# EAGLE schematic Battery Interface Module (EAGLE 5.12)
AUTHORNAME: Aaron Bonnell-Kangas; BOARDNAME: Battery Interface Module; BOM: EXCLUDE; DATABASE: ../../../Component libraries/partsdb.txt; DNP: T; PARTNO: LGQ971; RELEASE: RELEASE; REVISIONDATE: v2.0.1 - 2015-04-01; TP_NAME: 1-SCLK_H

## Sheet 1 of 15
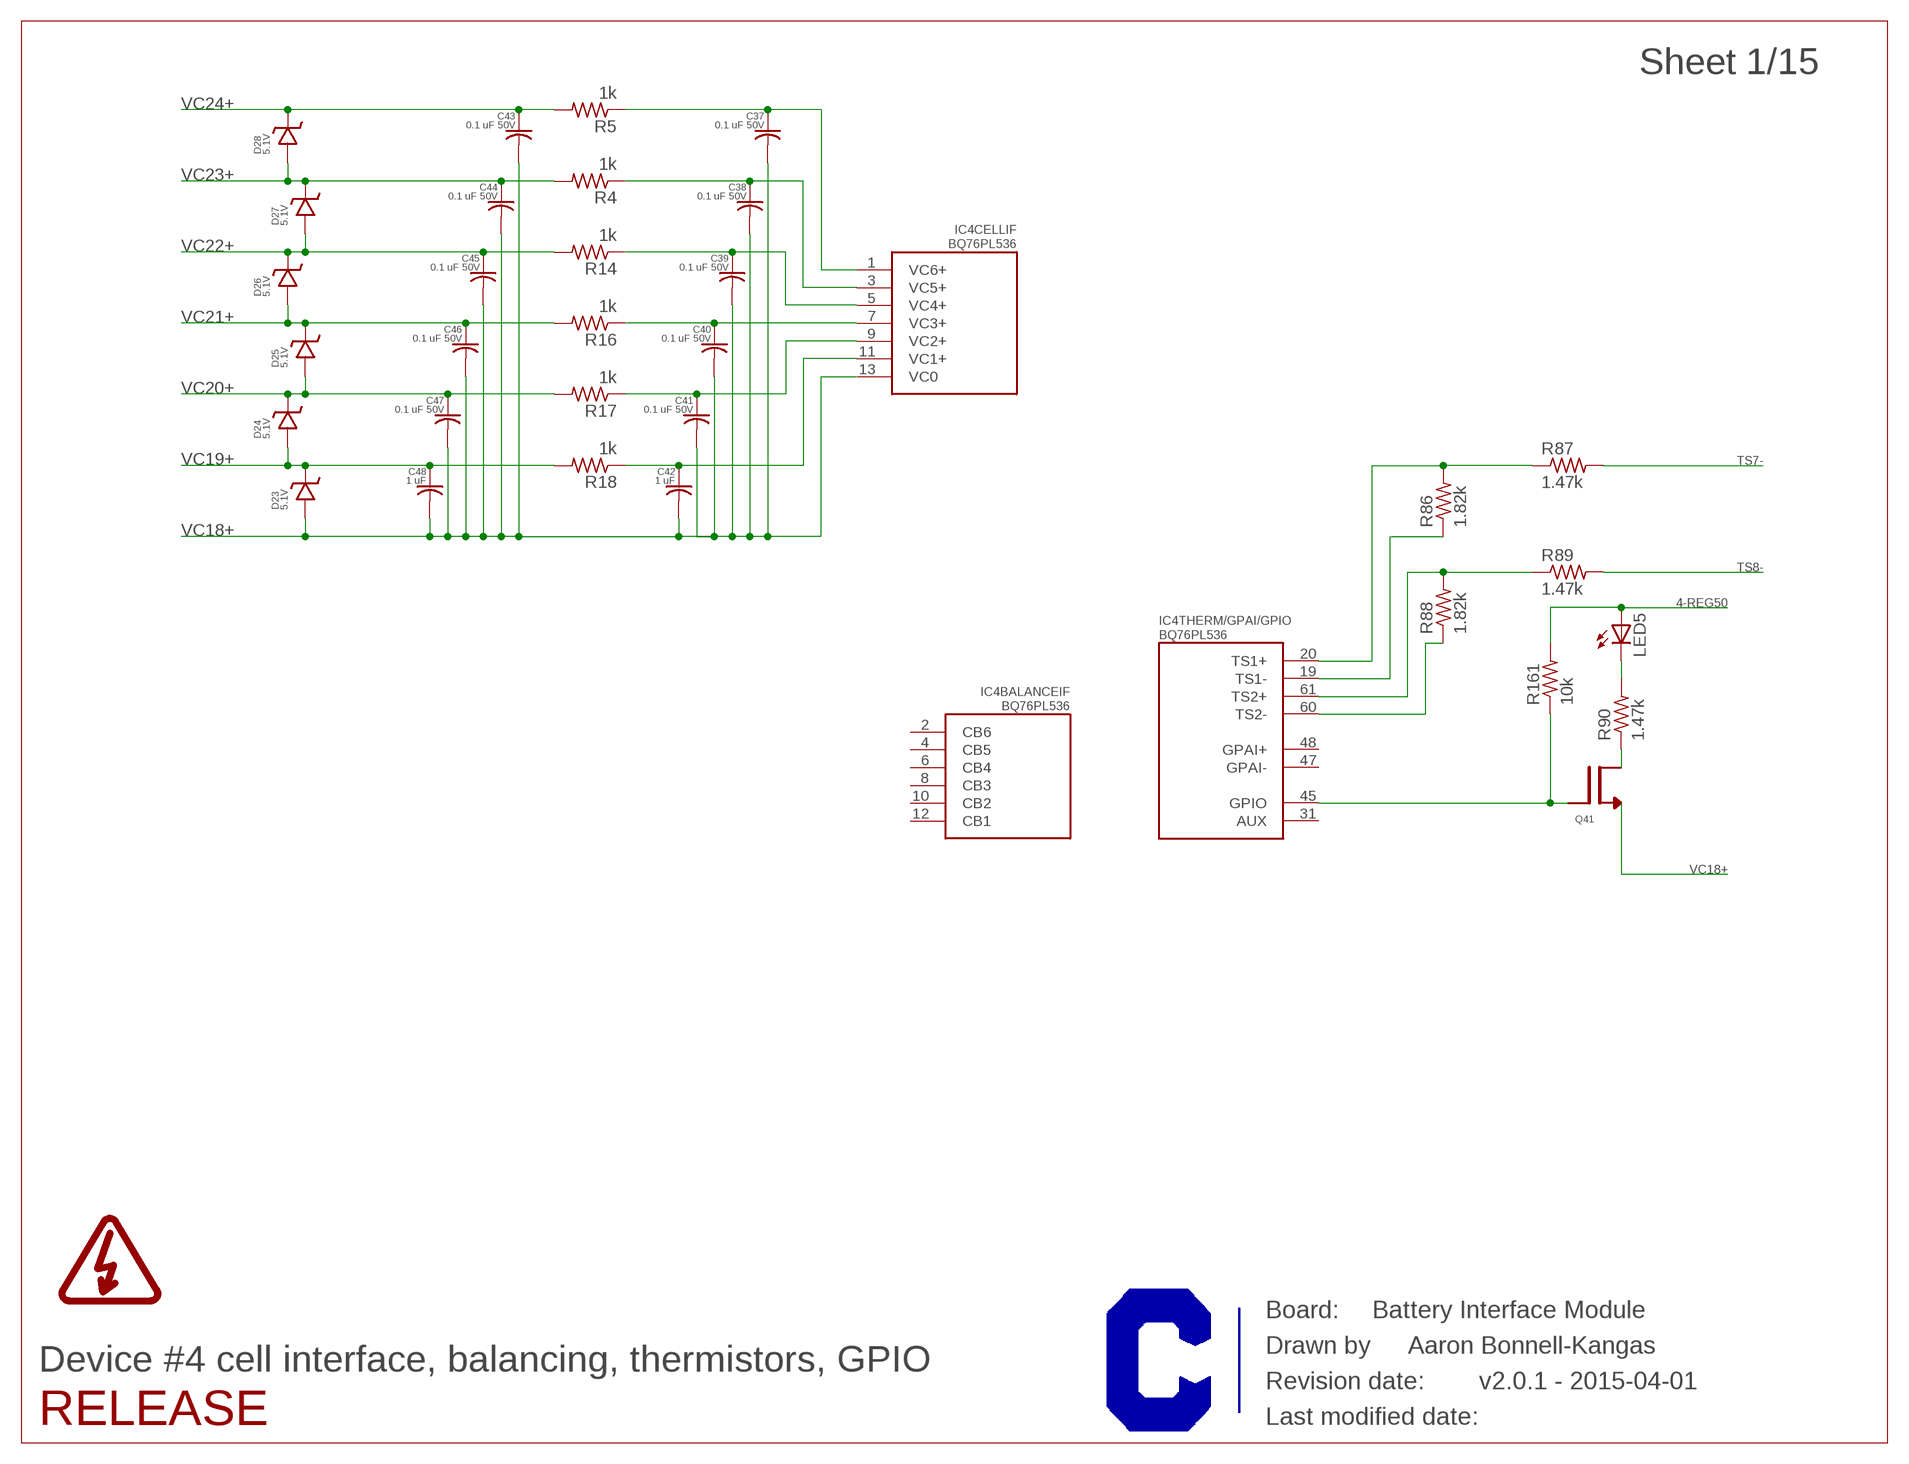
[diagram p0: schematic, sheet 1]

### Parts
C37  0.1 uF 50V  C-USC0603  [C0603]
C38  0.1 uF 50V  C-USC0603  [C0603]
C39  0.1 uF 50V  C-USC0603  [C0603]
C40  0.1 uF 50V  C-USC0603  [C0603]
C41  0.1 uF 50V  C-USC0603  [C0603]
C42  1 uF  C-USC0603  [C0603]
C43  0.1 uF 50V  C-USC0603  [C0603]
C44  0.1 uF 50V  C-USC0603  [C0603]
C45  0.1 uF 50V  C-USC0603  [C0603]
C46  0.1 uF 50V  C-USC0603  [C0603]
C47  0.1 uF 50V  C-USC0603  [C0603]
C48  1 uF  C-USC0603  [C0603]
D23  5.1V  ZENER_DIODE-SOD-323  [SOD-323]
D24  5.1V  ZENER_DIODE-SOD-323  [SOD-323]
D25  5.1V  ZENER_DIODE-SOD-323  [SOD-323]
D26  5.1V  ZENER_DIODE-SOD-323  [SOD-323]
D27  5.1V  ZENER_DIODE-SOD-323  [SOD-323]
D28  5.1V  ZENER_DIODE-SOD-323  [SOD-323]
IC4  BQ76PL536  [LQFP64-POWERPAD_(S-PQFP-G64)]
LED5  LEDCHIP-LED0603  [CHIP-LED0603]
Q41  FDN359AN  [SOT-23]
R4  1k  R-US_R0603  [R0603]
R5  1k  R-US_R0603  [R0603]
R14  1k  R-US_R0603  [R0603]
R16  1k  R-US_R0603  [R0603]
R17  1k  R-US_R0603  [R0603]
R18  1k  R-US_R0603  [R0603]
R86  1.82k  R-US_R0603  [R0603]
R87  1.47k  R-US_R0603  [R0603]
R88  1.82k  R-US_R0603  [R0603]
R89  1.47k  R-US_R0603  [R0603]
R90  1.47k  R-US_R0603  [R0603]
R161  10k  R-US_R0603  [R0603]
U$17  HV_SYMBOL  [HV_SYMBOL]

### Nets
4-GPIO: IC4.45(THERM/GPAI/GPIO:GPIO) Q41.1(GATE) R161.1
4-REG50: LED5.A R161.2 ; also sheet 2,9,15
N$34: C39.1 IC4.5(CELLIF:VC4+) R14.1
N$43: C37.1 IC4.1(CELLIF:VC6+) R5.1
N$44: C38.1 IC4.3(CELLIF:VC5+) R4.1
N$45: C41.1 IC4.9(CELLIF:VC2+) R17.1
N$47: C40.1 IC4.7(CELLIF:VC3+) R16.1
N$48: C42.1 IC4.11(CELLIF:VC1+) R18.1
N$108: IC4.19(THERM/GPAI/GPIO:TS1-) R86.1
N$109: IC4.20(THERM/GPAI/GPIO:TS1+) R86.2 R87.1
N$110: IC4.61(THERM/GPAI/GPIO:TS2+) R88.2 R89.1
N$111: IC4.60(THERM/GPAI/GPIO:TS2-) R88.1
N$114: Q41.3(DRAIN) R90.1
N$115: LED5.C R90.2
TS7-: R87.2 ; also sheet 9
TS8-: R89.2 ; also sheet 9
VC18+ [HV]: C37.2 C38.2 C39.2 C40.2 C41.2 C42.2 C43.2 C44.2 C45.2 C46.2 C47.2 C48.2 D23.ANODE IC4.13(CELLIF:VC0) Q41.2(SOURCE) ; also sheet 2,3,4,9
VC19+: C48.1 D23.CATHODE D24.ANODE R18.2 ; also sheet 9
VC20+: C47.1 D24.CATHODE D25.ANODE R17.2 ; also sheet 9
VC21+: C46.1 D25.CATHODE D26.ANODE R16.2 ; also sheet 9
VC22+: C45.1 D26.CATHODE D27.ANODE R14.2 ; also sheet 9
VC23+: C44.1 D27.CATHODE D28.ANODE R4.2 ; also sheet 9
VC24+ [HV]: C43.1 D28.CATHODE R5.2 ; also sheet 2,9,15
Unconnected: IC4.2(BALANCEIF:CB6) IC4.4(BALANCEIF:CB5) IC4.6(BALANCEIF:CB4) IC4.8(BALANCEIF:CB3) IC4.10(BALANCEIF:CB2) IC4.12(BALANCEIF:CB1) IC4.31(THERM/GPAI/GPIO:AUX) IC4.47(THERM/GPAI/GPIO:GPAI-) IC4.48(THERM/GPAI/GPIO:GPAI+)

### Notes on the sheet
- Device #4 cell interface, balancing, thermistors, GPIO

## Sheet 2 of 15
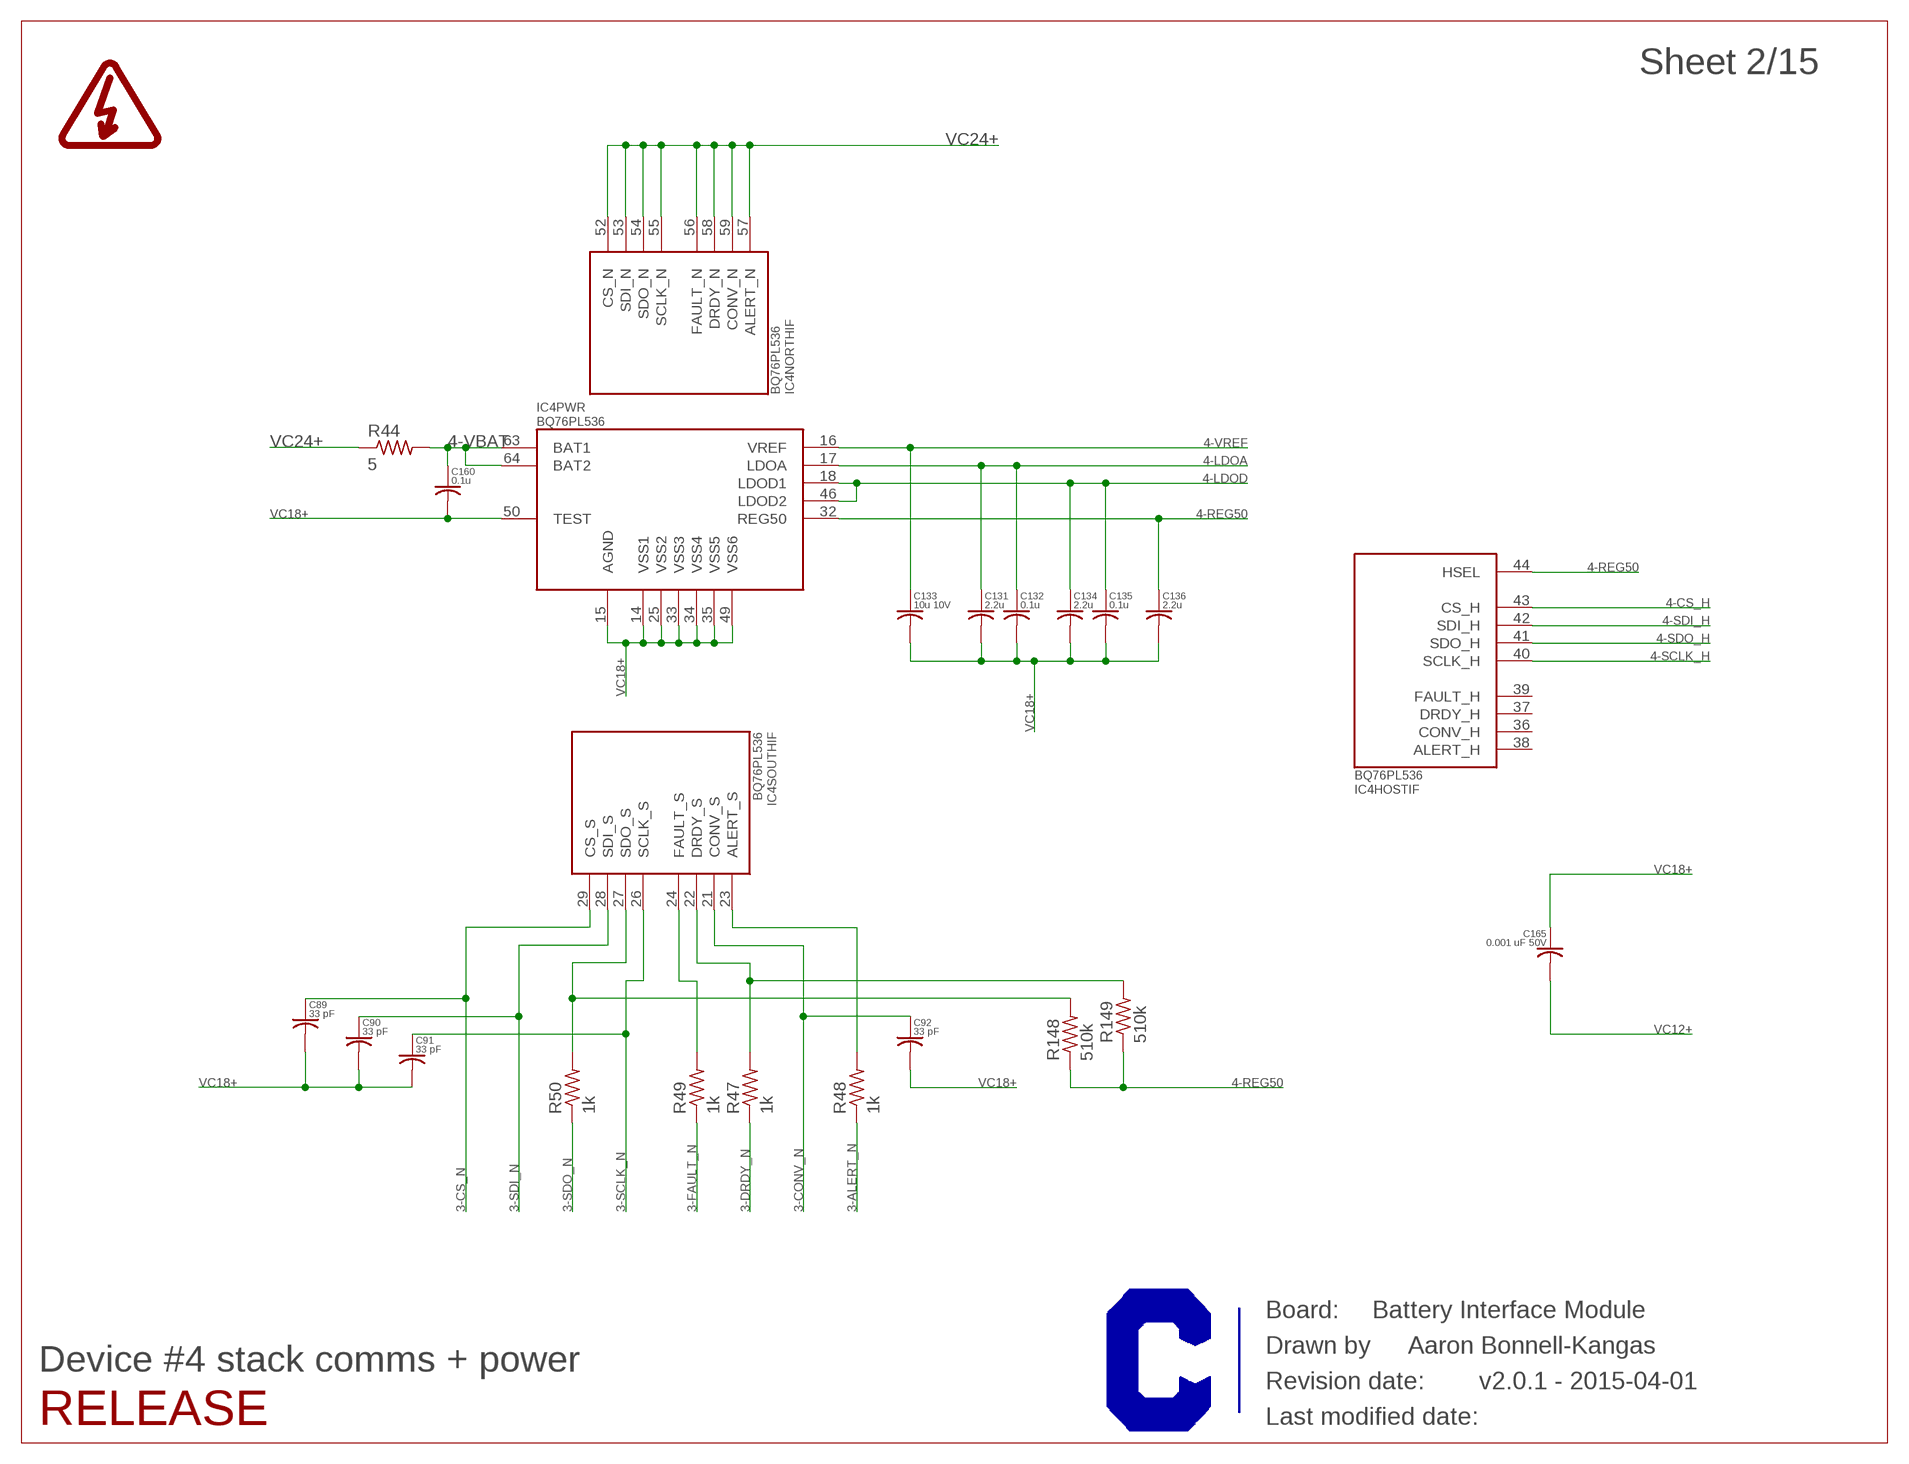
[diagram p1: schematic, sheet 2]

### Parts
C89  33 pF  C-USC0402  [C0402]
C90  33 pF  C-USC0402  [C0402]
C91  33 pF  C-USC0402  [C0402]
C92  33 pF  C-USC0402  [C0402]
C131  2.2u  C-USC0603  [C0603]
C132  0.1u  C-USC0603  [C0603]
C133  10u 10V  C-USC0805  [C0805]
C134  2.2u  C-USC0603  [C0603]
C135  0.1u  C-USC0603  [C0603]
C136  2.2u  C-USC0603  [C0603]
C160  0.1u  C-USC0603  [C0603]
C165  0.001 uF 50V  C-USC0603  [C0603]
R44  5  R-US_R0603  [R0603]
R47  1k  R-US_R0402  [R0402]
R48  1k  R-US_R0402  [R0402]
R49  1k  R-US_R0402  [R0402]
R50  1k  R-US_R0402  [R0402]
R148  510k  R-US_R0603  [R0603]
R149  510k  R-US_R0603  [R0603]
U$2  HV_SYMBOL  [HV_SYMBOL]

### Nets
3-ALERT_N: R48.1 ; also sheet 4
3-CONV_N: C92.1 IC4.21(SOUTHIF:CONV_S) ; also sheet 4
3-CS_N: C89.1 IC4.29(SOUTHIF:CS_S) ; also sheet 4
3-DRDY_N: R47.1 ; also sheet 4
3-FAULT_N: R49.1 ; also sheet 4
3-SCLK_N: C91.1 IC4.26(SOUTHIF:SCLK_S) ; also sheet 4
3-SDI_N: C90.1 IC4.28(SOUTHIF:SDI_S) ; also sheet 4
3-SDO_N: R50.1 ; also sheet 4
4-CS_H: IC4.43(HOSTIF:CS_H) ; also sheet 15
4-LDOA: C131.1 C132.1 IC4.17(PWR:LDOA)
4-LDOD: C134.1 C135.1 IC4.18(PWR:LDOD1) IC4.46(PWR:LDOD2)
4-REG50: C136.1 IC4.32(PWR:REG50) IC4.44(HOSTIF:HSEL) R148.1 R149.1 ; also sheet 1,9,15
4-SCLK_H: IC4.40(HOSTIF:SCLK_H) ; also sheet 15
4-SDI_H: IC4.42(HOSTIF:SDI_H) ; also sheet 15
4-SDO_H: IC4.41(HOSTIF:SDO_H) ; also sheet 15
4-VBAT: C160.1 IC4.63(PWR:BAT1) IC4.64(PWR:BAT2) R44.2
4-VREF: C133.1 IC4.16(PWR:VREF)
N$205: IC4.24(SOUTHIF:FAULT_S) R49.2
N$207: IC4.23(SOUTHIF:ALERT_S) R48.2
N$209: IC4.22(SOUTHIF:DRDY_S) R47.2 R149.2
N$210: IC4.27(SOUTHIF:SDO_S) R50.2 R148.2
VC12+ [HV]: C165.2 ; also sheet 3,4,5,6,9,15
VC18+ [HV]: C89.2 C90.2 C91.2 C92.2 C131.2 C132.2 C133.2 C134.2 C135.2 C136.2 C160.2 C165.1 IC4.14(PWR:VSS1) IC4.15(PWR:AGND) IC4.25(PWR:VSS2) IC4.33(PWR:VSS3) IC4.34(PWR:VSS4) IC4.35(PWR:VSS5) IC4.49(PWR:VSS6) IC4.50(PWR:TEST) ; also sheet 1,3,4,9
VC24+ [HV]: IC4.52(NORTHIF:CS_N) IC4.53(NORTHIF:SDI_N) IC4.54(NORTHIF:SDO_N) IC4.55(NORTHIF:SCLK_N) IC4.56(NORTHIF:FAULT_N) IC4.57(NORTHIF:ALERT_N) IC4.58(NORTHIF:DRDY_N) IC4.59(NORTHIF:CONV_N) R44.1 ; also sheet 1,9,15
Unconnected: IC4.36(HOSTIF:CONV_H) IC4.37(HOSTIF:DRDY_H) IC4.38(HOSTIF:ALERT_H) IC4.39(HOSTIF:FAULT_H)

### Notes on the sheet
- Device #4 stack comms + power

## Sheet 3 of 15
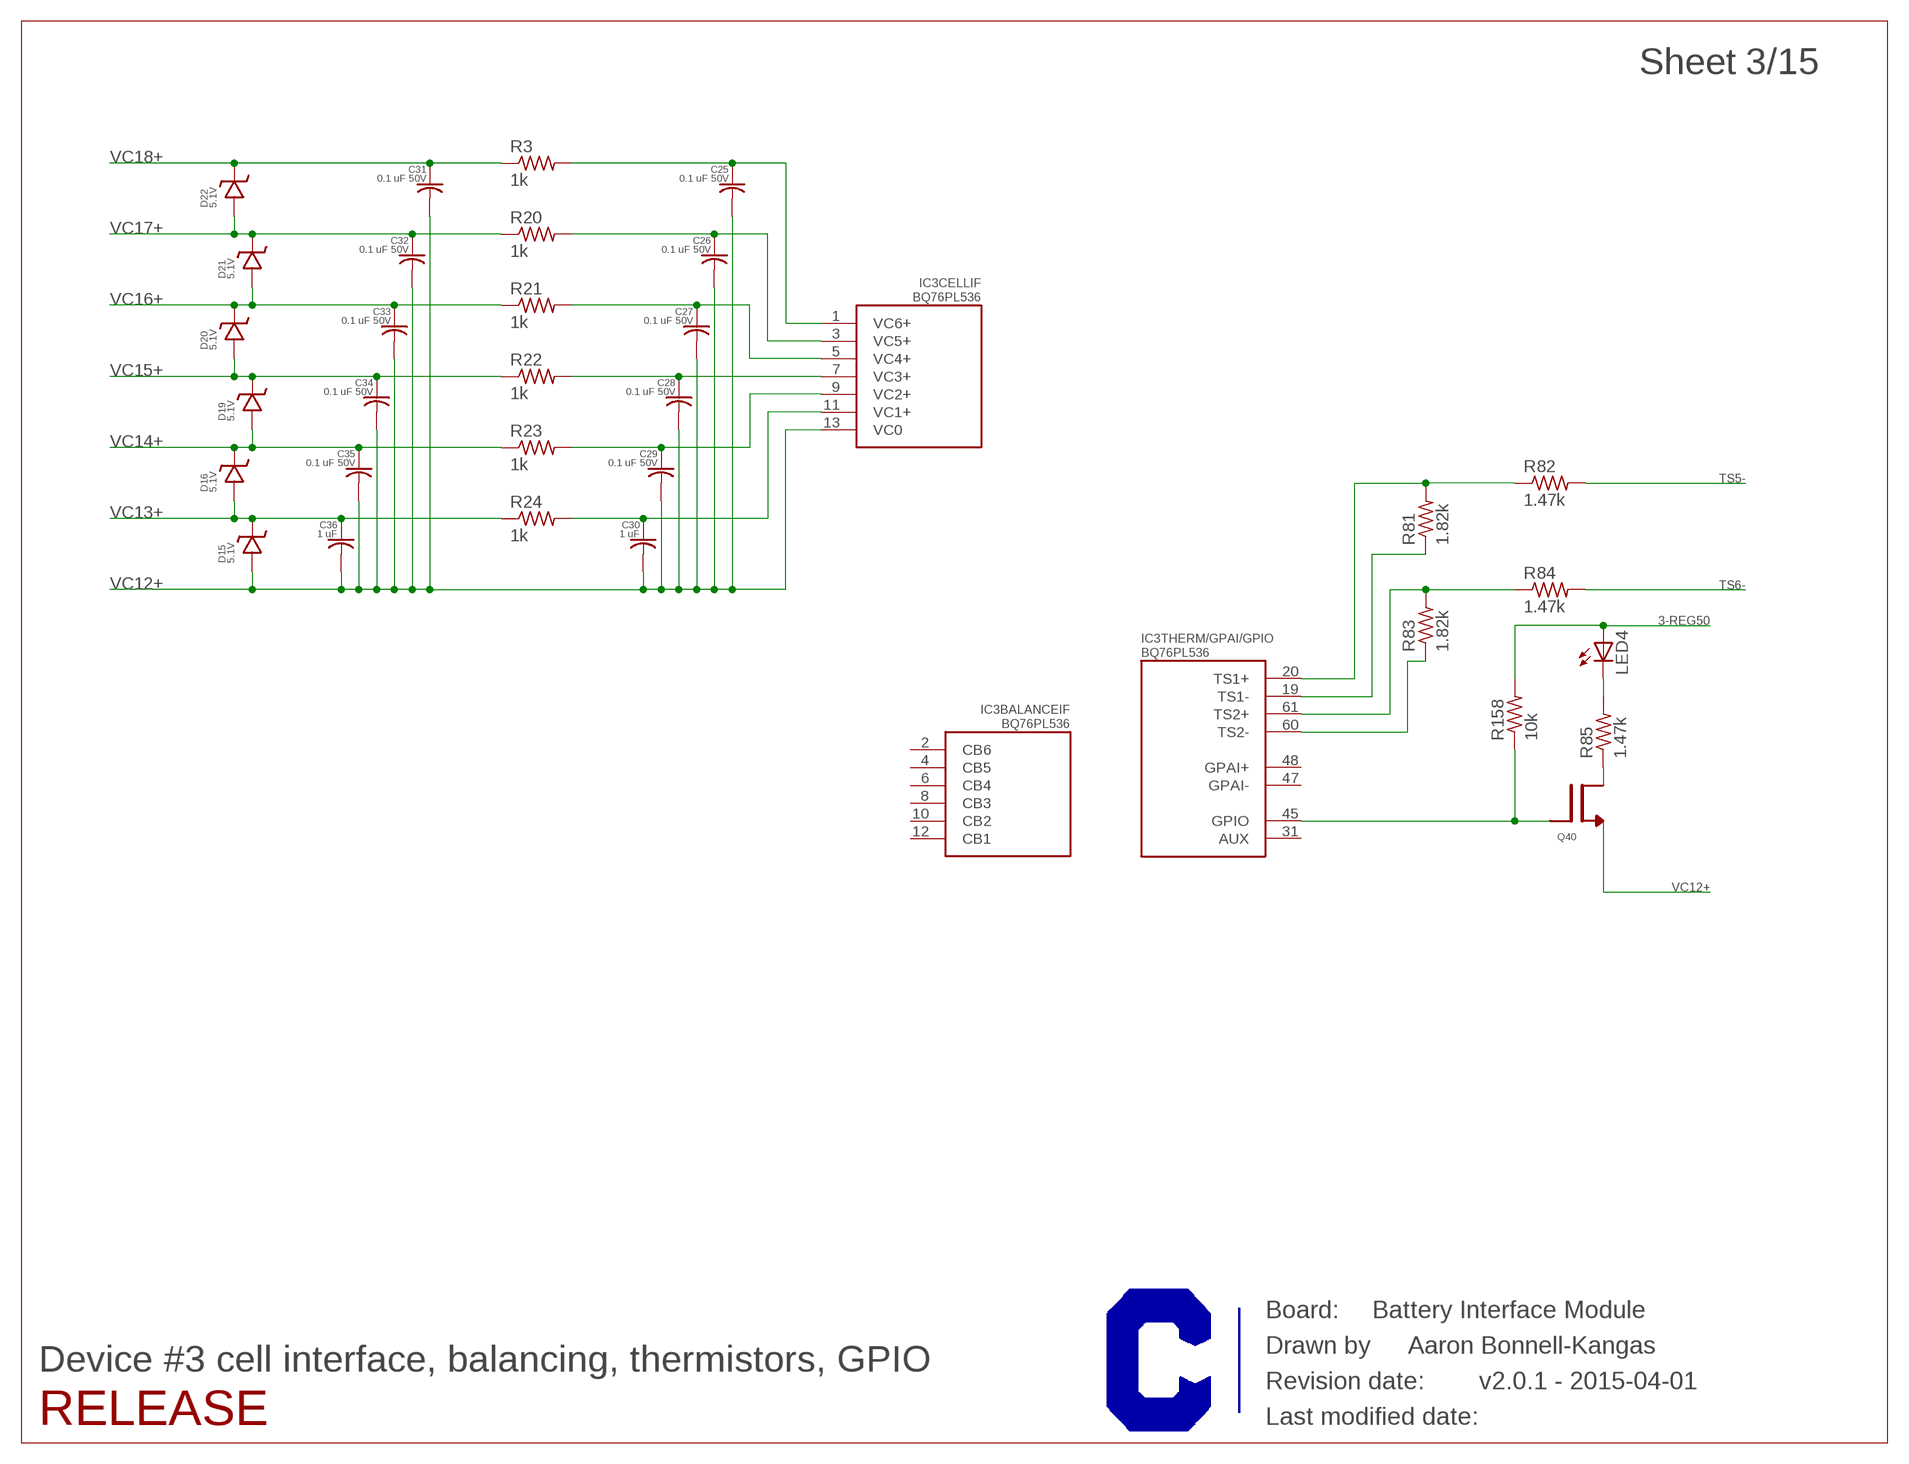
[diagram p2: schematic, sheet 3]

### Parts
C25  0.1 uF 50V  C-USC0603  [C0603]
C26  0.1 uF 50V  C-USC0603  [C0603]
C27  0.1 uF 50V  C-USC0603  [C0603]
C28  0.1 uF 50V  C-USC0603  [C0603]
C29  0.1 uF 50V  C-USC0603  [C0603]
C30  1 uF  C-USC0603  [C0603]
C31  0.1 uF 50V  C-USC0603  [C0603]
C32  0.1 uF 50V  C-USC0603  [C0603]
C33  0.1 uF 50V  C-USC0603  [C0603]
C34  0.1 uF 50V  C-USC0603  [C0603]
C35  0.1 uF 50V  C-USC0603  [C0603]
C36  1 uF  C-USC0603  [C0603]
D15  5.1V  ZENER_DIODE-SOD-323  [SOD-323]
D16  5.1V  ZENER_DIODE-SOD-323  [SOD-323]
D19  5.1V  ZENER_DIODE-SOD-323  [SOD-323]
D20  5.1V  ZENER_DIODE-SOD-323  [SOD-323]
D21  5.1V  ZENER_DIODE-SOD-323  [SOD-323]
D22  5.1V  ZENER_DIODE-SOD-323  [SOD-323]
IC3  BQ76PL536  [LQFP64-POWERPAD_(S-PQFP-G64)]
LED4  LEDCHIP-LED0603  [CHIP-LED0603]
Q40  FDN359AN  [SOT-23]
R3  1k  R-US_R0603  [R0603]
R20  1k  R-US_R0603  [R0603]
R21  1k  R-US_R0603  [R0603]
R22  1k  R-US_R0603  [R0603]
R23  1k  R-US_R0603  [R0603]
R24  1k  R-US_R0603  [R0603]
R81  1.82k  R-US_R0603  [R0603]
R82  1.47k  R-US_R0603  [R0603]
R83  1.82k  R-US_R0603  [R0603]
R84  1.47k  R-US_R0603  [R0603]
R85  1.47k  R-US_R0603  [R0603]
R158  10k  R-US_R0603  [R0603]

### Nets
3-GPIO: IC3.45(THERM/GPAI/GPIO:GPIO) Q40.1(GATE) R158.1
3-REG50: LED4.A R158.2 ; also sheet 4,9,15
N$15: C25.1 IC3.1(CELLIF:VC6+) R3.2
N$20: C30.1 IC3.11(CELLIF:VC1+) R24.2
N$29: C28.1 IC3.7(CELLIF:VC3+) R22.2
N$30: C26.1 IC3.3(CELLIF:VC5+) R20.2
N$31: C27.1 IC3.5(CELLIF:VC4+) R21.2
N$33: C29.1 IC3.9(CELLIF:VC2+) R23.2
N$78: IC3.19(THERM/GPAI/GPIO:TS1-) R81.1
N$80: IC3.20(THERM/GPAI/GPIO:TS1+) R81.2 R82.1
N$82: IC3.61(THERM/GPAI/GPIO:TS2+) R83.2 R84.1
N$94: IC3.60(THERM/GPAI/GPIO:TS2-) R83.1
N$105: Q40.3(DRAIN) R85.1
N$106: LED4.C R85.2
TS5-: R82.2 ; also sheet 9
TS6-: R84.2 ; also sheet 9
VC12+ [HV]: C25.2 C26.2 C27.2 C28.2 C29.2 C30.2 C31.2 C32.2 C33.2 C34.2 C35.2 C36.2 D15.ANODE IC3.13(CELLIF:VC0) Q40.2(SOURCE) ; also sheet 2,4,5,6,9,15
VC13+: C36.1 D15.CATHODE D16.ANODE R24.1 ; also sheet 9
VC14+: C35.1 D16.CATHODE D19.ANODE R23.1 ; also sheet 9
VC15+: C34.1 D19.CATHODE D20.ANODE R22.1 ; also sheet 9
VC16+: C33.1 D20.CATHODE D21.ANODE R21.1 ; also sheet 9
VC17+: C32.1 D21.CATHODE D22.ANODE R20.1 ; also sheet 9
VC18+ [HV]: C31.1 D22.CATHODE R3.1 ; also sheet 1,2,4,9
Unconnected: IC3.2(BALANCEIF:CB6) IC3.4(BALANCEIF:CB5) IC3.6(BALANCEIF:CB4) IC3.8(BALANCEIF:CB3) IC3.10(BALANCEIF:CB2) IC3.12(BALANCEIF:CB1) IC3.31(THERM/GPAI/GPIO:AUX) IC3.47(THERM/GPAI/GPIO:GPAI-) IC3.48(THERM/GPAI/GPIO:GPAI+)

### Notes on the sheet
- Device #3 cell interface, balancing, thermistors, GPIO

## Sheet 4 of 15
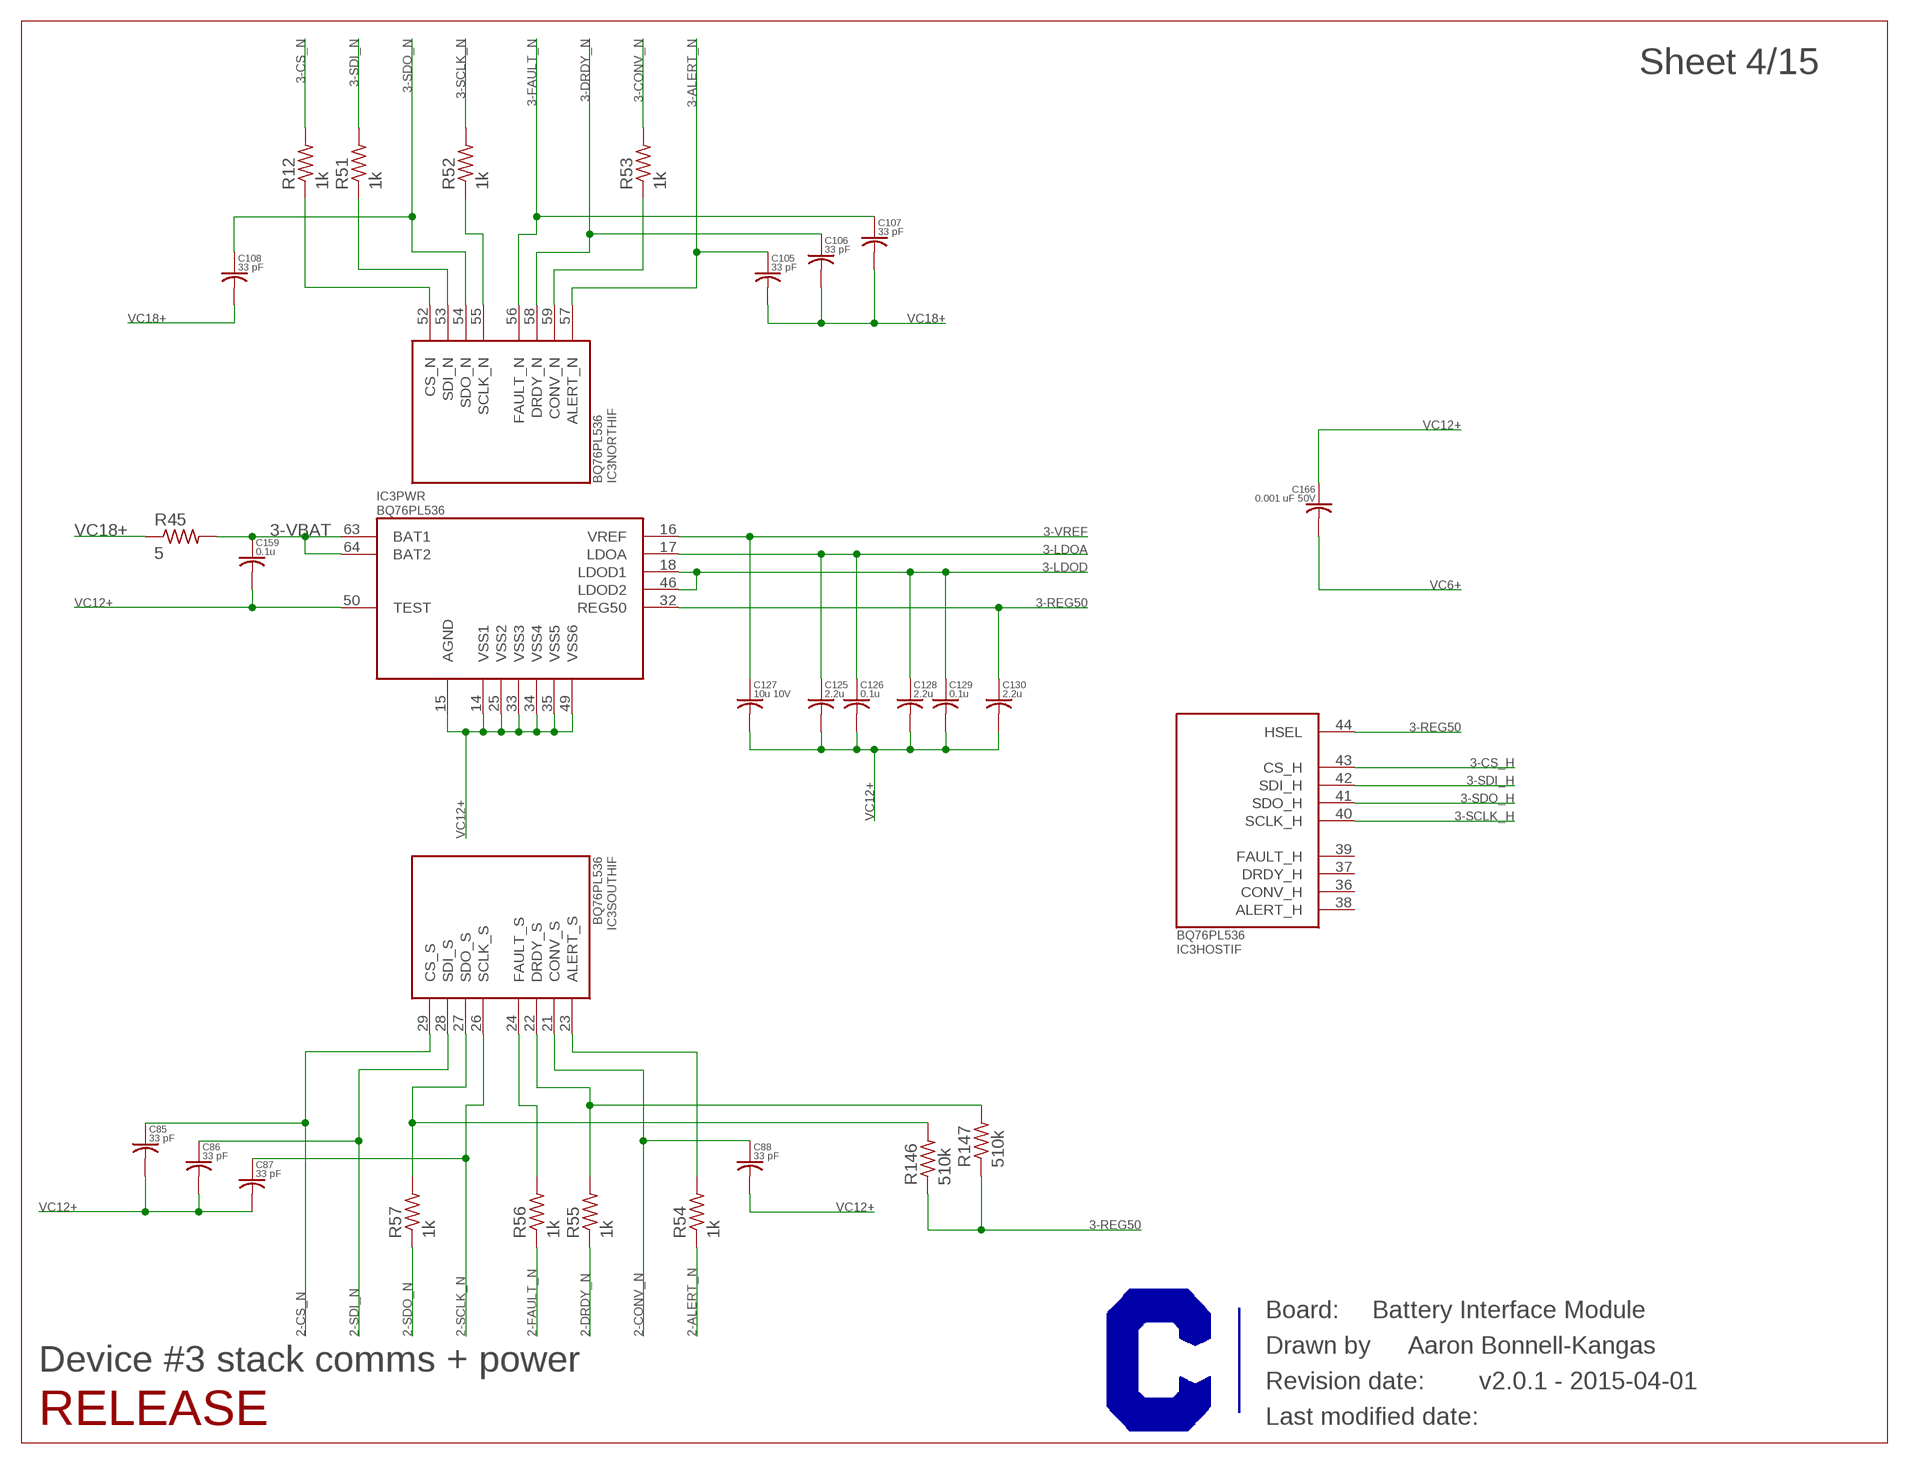
[diagram p3: schematic, sheet 4]

### Parts
C85  33 pF  C-USC0402  [C0402]
C86  33 pF  C-USC0402  [C0402]
C87  33 pF  C-USC0402  [C0402]
C88  33 pF  C-USC0402  [C0402]
C105  33 pF  C-USC0402  [C0402]
C106  33 pF  C-USC0402  [C0402]
C107  33 pF  C-USC0402  [C0402]
C108  33 pF  C-USC0402  [C0402]
C125  2.2u  C-USC0603  [C0603]
C126  0.1u  C-USC0603  [C0603]
C127  10u 10V  C-USC0805  [C0805]
C128  2.2u  C-USC0603  [C0603]
C129  0.1u  C-USC0603  [C0603]
C130  2.2u  C-USC0603  [C0603]
C159  0.1u  C-USC0603  [C0603]
C166  0.001 uF 50V  C-USC0603  [C0603]
R12  1k  R-US_R0402  [R0402]
R45  5  R-US_R0603  [R0603]
R51  1k  R-US_R0402  [R0402]
R52  1k  R-US_R0402  [R0402]
R53  1k  R-US_R0402  [R0402]
R54  1k  R-US_R0402  [R0402]
R55  1k  R-US_R0402  [R0402]
R56  1k  R-US_R0402  [R0402]
R57  1k  R-US_R0402  [R0402]
R146  510k  R-US_R0402  [R0402]
R147  510k  R-US_R0402  [R0402]

### Nets
2-ALERT_N: R54.1 ; also sheet 6
2-CONV_N: C88.1 IC3.21(SOUTHIF:CONV_S) ; also sheet 6
2-CS_N: C85.1 IC3.29(SOUTHIF:CS_S) ; also sheet 6
2-DRDY_N: R55.1 ; also sheet 6
2-FAULT_N: R56.1 ; also sheet 6
2-SCLK_N: C87.1 IC3.26(SOUTHIF:SCLK_S) ; also sheet 6
2-SDI_N: C86.1 IC3.28(SOUTHIF:SDI_S) ; also sheet 6
2-SDO_N: R57.1 ; also sheet 6
3-ALERT_N: C105.1 IC3.57(NORTHIF:ALERT_N) ; also sheet 2
3-CONV_N: R53.2 ; also sheet 2
3-CS_H: IC3.43(HOSTIF:CS_H) ; also sheet 15
3-CS_N: R12.2 ; also sheet 2
3-DRDY_N: C106.1 IC3.58(NORTHIF:DRDY_N) ; also sheet 2
3-FAULT_N: C107.1 IC3.56(NORTHIF:FAULT_N) ; also sheet 2
3-LDOA: C125.1 C126.1 IC3.17(PWR:LDOA)
3-LDOD: C128.1 C129.1 IC3.18(PWR:LDOD1) IC3.46(PWR:LDOD2)
3-REG50: C130.1 IC3.32(PWR:REG50) IC3.44(HOSTIF:HSEL) R146.1 R147.1 ; also sheet 3,9,15
3-SCLK_H: IC3.40(HOSTIF:SCLK_H) ; also sheet 15
3-SCLK_N: R52.2 ; also sheet 2
3-SDI_H: IC3.42(HOSTIF:SDI_H) ; also sheet 15
3-SDI_N: R51.2 ; also sheet 2
3-SDO_H: IC3.41(HOSTIF:SDO_H) ; also sheet 15
3-SDO_N: C108.1 IC3.54(NORTHIF:SDO_N) ; also sheet 2
3-VBAT: C159.1 IC3.63(PWR:BAT1) IC3.64(PWR:BAT2) R45.2
3-VREF: C127.1 IC3.16(PWR:VREF)
N$79: IC3.24(SOUTHIF:FAULT_S) R56.2
N$81: IC3.23(SOUTHIF:ALERT_S) R54.2
N$83: IC3.22(SOUTHIF:DRDY_S) R55.2 R147.2
N$84: IC3.27(SOUTHIF:SDO_S) R57.2 R146.2
N$254: IC3.59(NORTHIF:CONV_N) R53.1
N$257: IC3.55(NORTHIF:SCLK_N) R52.1
N$259: IC3.53(NORTHIF:SDI_N) R51.1
N$260: IC3.52(NORTHIF:CS_N) R12.1
VC6+ [HV]: C166.2 ; also sheet 5,6,7,8,9,15
VC12+ [HV]: C85.2 C86.2 C87.2 C88.2 C125.2 C126.2 C127.2 C128.2 C129.2 C130.2 C159.2 C166.1 IC3.14(PWR:VSS1) IC3.15(PWR:AGND) IC3.25(PWR:VSS2) IC3.33(PWR:VSS3) IC3.34(PWR:VSS4) IC3.35(PWR:VSS5) IC3.49(PWR:VSS6) IC3.50(PWR:TEST) ; also sheet 2,3,5,6,9,15
VC18+ [HV]: C105.2 C106.2 C107.2 C108.2 R45.1 ; also sheet 1,2,3,9
Unconnected: IC3.36(HOSTIF:CONV_H) IC3.37(HOSTIF:DRDY_H) IC3.38(HOSTIF:ALERT_H) IC3.39(HOSTIF:FAULT_H)

### Notes on the sheet
- Device #3 stack comms + power

## Sheet 5 of 15
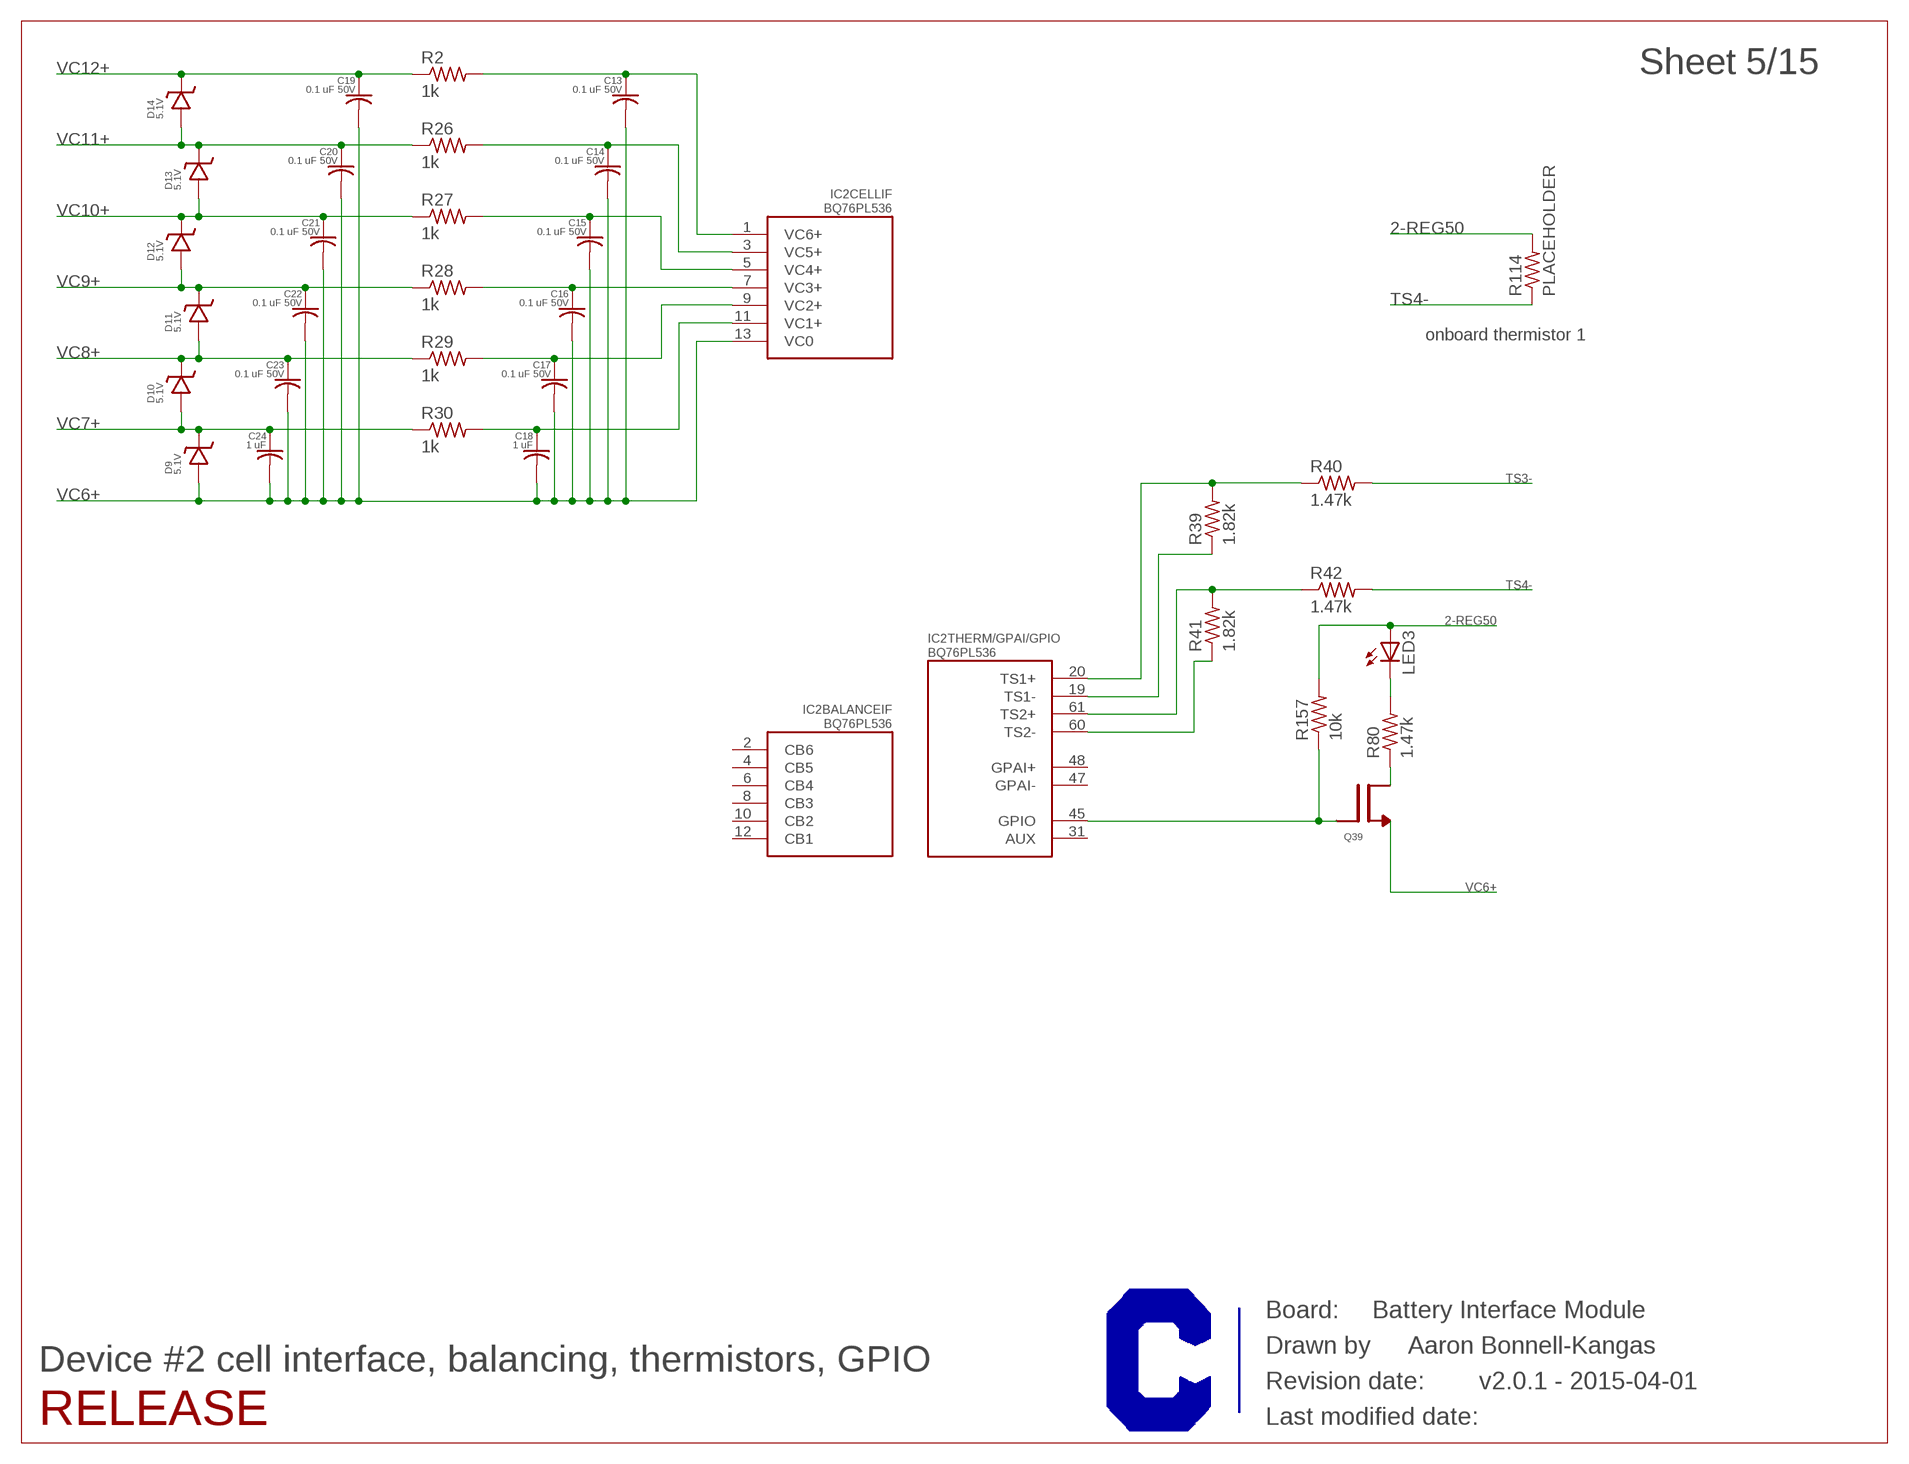
[diagram p4: schematic, sheet 5]

### Parts
C13  0.1 uF 50V  C-USC0603  [C0603]
C14  0.1 uF 50V  C-USC0603  [C0603]
C15  0.1 uF 50V  C-USC0603  [C0603]
C16  0.1 uF 50V  C-USC0603  [C0603]
C17  0.1 uF 50V  C-USC0603  [C0603]
C18  1 uF  C-USC0603  [C0603]
C19  0.1 uF 50V  C-USC0603  [C0603]
C20  0.1 uF 50V  C-USC0603  [C0603]
C21  0.1 uF 50V  C-USC0603  [C0603]
C22  0.1 uF 50V  C-USC0603  [C0603]
C23  0.1 uF 50V  C-USC0603  [C0603]
C24  1 uF  C-USC0603  [C0603]
D9  5.1V  ZENER_DIODE-SOD-323  [SOD-323]
D10  5.1V  ZENER_DIODE-SOD-323  [SOD-323]
D11  5.1V  ZENER_DIODE-SOD-323  [SOD-323]
D12  5.1V  ZENER_DIODE-SOD-323  [SOD-323]
D13  5.1V  ZENER_DIODE-SOD-323  [SOD-323]
D14  5.1V  ZENER_DIODE-SOD-323  [SOD-323]
IC2  BQ76PL536  [LQFP64-POWERPAD_(S-PQFP-G64)]
LED3  LEDCHIP-LED0603  [CHIP-LED0603]
Q39  FDN359AN  [SOT-23]
R2  1k  R-US_R0603  [R0603]
R26  1k  R-US_R0603  [R0603]
R27  1k  R-US_R0603  [R0603]
R28  1k  R-US_R0603  [R0603]
R29  1k  R-US_R0603  [R0603]
R30  1k  R-US_R0603  [R0603]
R39  1.82k  R-US_R0603  [R0603]
R40  1.47k  R-US_R0603  [R0603]
R41  1.82k  R-US_R0402  [R0402]
R42  1.47k  R-US_R0402  [R0402]
R80  1.47k  R-US_R0603  [R0603]
R114  PLACEHOLDER  R-US_R0603  [R0603]
R157  10k  R-US_R0603  [R0603]

### Nets
2-GPIO: IC2.45(THERM/GPAI/GPIO:GPIO) Q39.1(GATE) R157.1
2-REG50: LED3.A R114.2 R157.2 ; also sheet 6,9,15
N$4: C18.1 IC2.11(CELLIF:VC1+) R30.2
N$6: C13.1 IC2.1(CELLIF:VC6+) R2.2
N$8: IC2.19(THERM/GPAI/GPIO:TS1-) R39.1
N$13: IC2.20(THERM/GPAI/GPIO:TS1+) R39.2 R40.1
N$16: C14.1 IC2.3(CELLIF:VC5+) R26.2
N$17: C15.1 IC2.5(CELLIF:VC4+) R27.2
N$18: C16.1 IC2.7(CELLIF:VC3+) R28.2
N$19: C17.1 IC2.9(CELLIF:VC2+) R29.2
N$28: IC2.61(THERM/GPAI/GPIO:TS2+) R41.2 R42.1
N$38: IC2.60(THERM/GPAI/GPIO:TS2-) R41.1
N$68: Q39.3(DRAIN) R80.1
N$69: LED3.C R80.2
TS3-: R40.2 ; also sheet 9
TS4-: R42.2 R114.1
VC6+ [HV]: C13.2 C14.2 C15.2 C16.2 C17.2 C18.2 C19.2 C20.2 C21.2 C22.2 C23.2 C24.2 D9.ANODE IC2.13(CELLIF:VC0) Q39.2(SOURCE) ; also sheet 4,6,7,8,9,15
VC7+: C24.1 D9.CATHODE D10.ANODE R30.1 ; also sheet 9
VC8+: C23.1 D10.CATHODE D11.ANODE R29.1 ; also sheet 9
VC9+: C22.1 D11.CATHODE D12.ANODE R28.1 ; also sheet 9
VC10+: C21.1 D12.CATHODE D13.ANODE R27.1 ; also sheet 9
VC11+: C20.1 D13.CATHODE D14.ANODE R26.1 ; also sheet 9
VC12+ [HV]: C19.1 D14.CATHODE R2.1 ; also sheet 2,3,4,6,9,15
Unconnected: IC2.2(BALANCEIF:CB6) IC2.4(BALANCEIF:CB5) IC2.6(BALANCEIF:CB4) IC2.8(BALANCEIF:CB3) IC2.10(BALANCEIF:CB2) IC2.12(BALANCEIF:CB1) IC2.31(THERM/GPAI/GPIO:AUX) IC2.47(THERM/GPAI/GPIO:GPAI-) IC2.48(THERM/GPAI/GPIO:GPAI+)

### Notes on the sheet
- onboard thermistor 1
- Device #2 cell interface, balancing, thermistors, GPIO

## Sheet 6 of 15
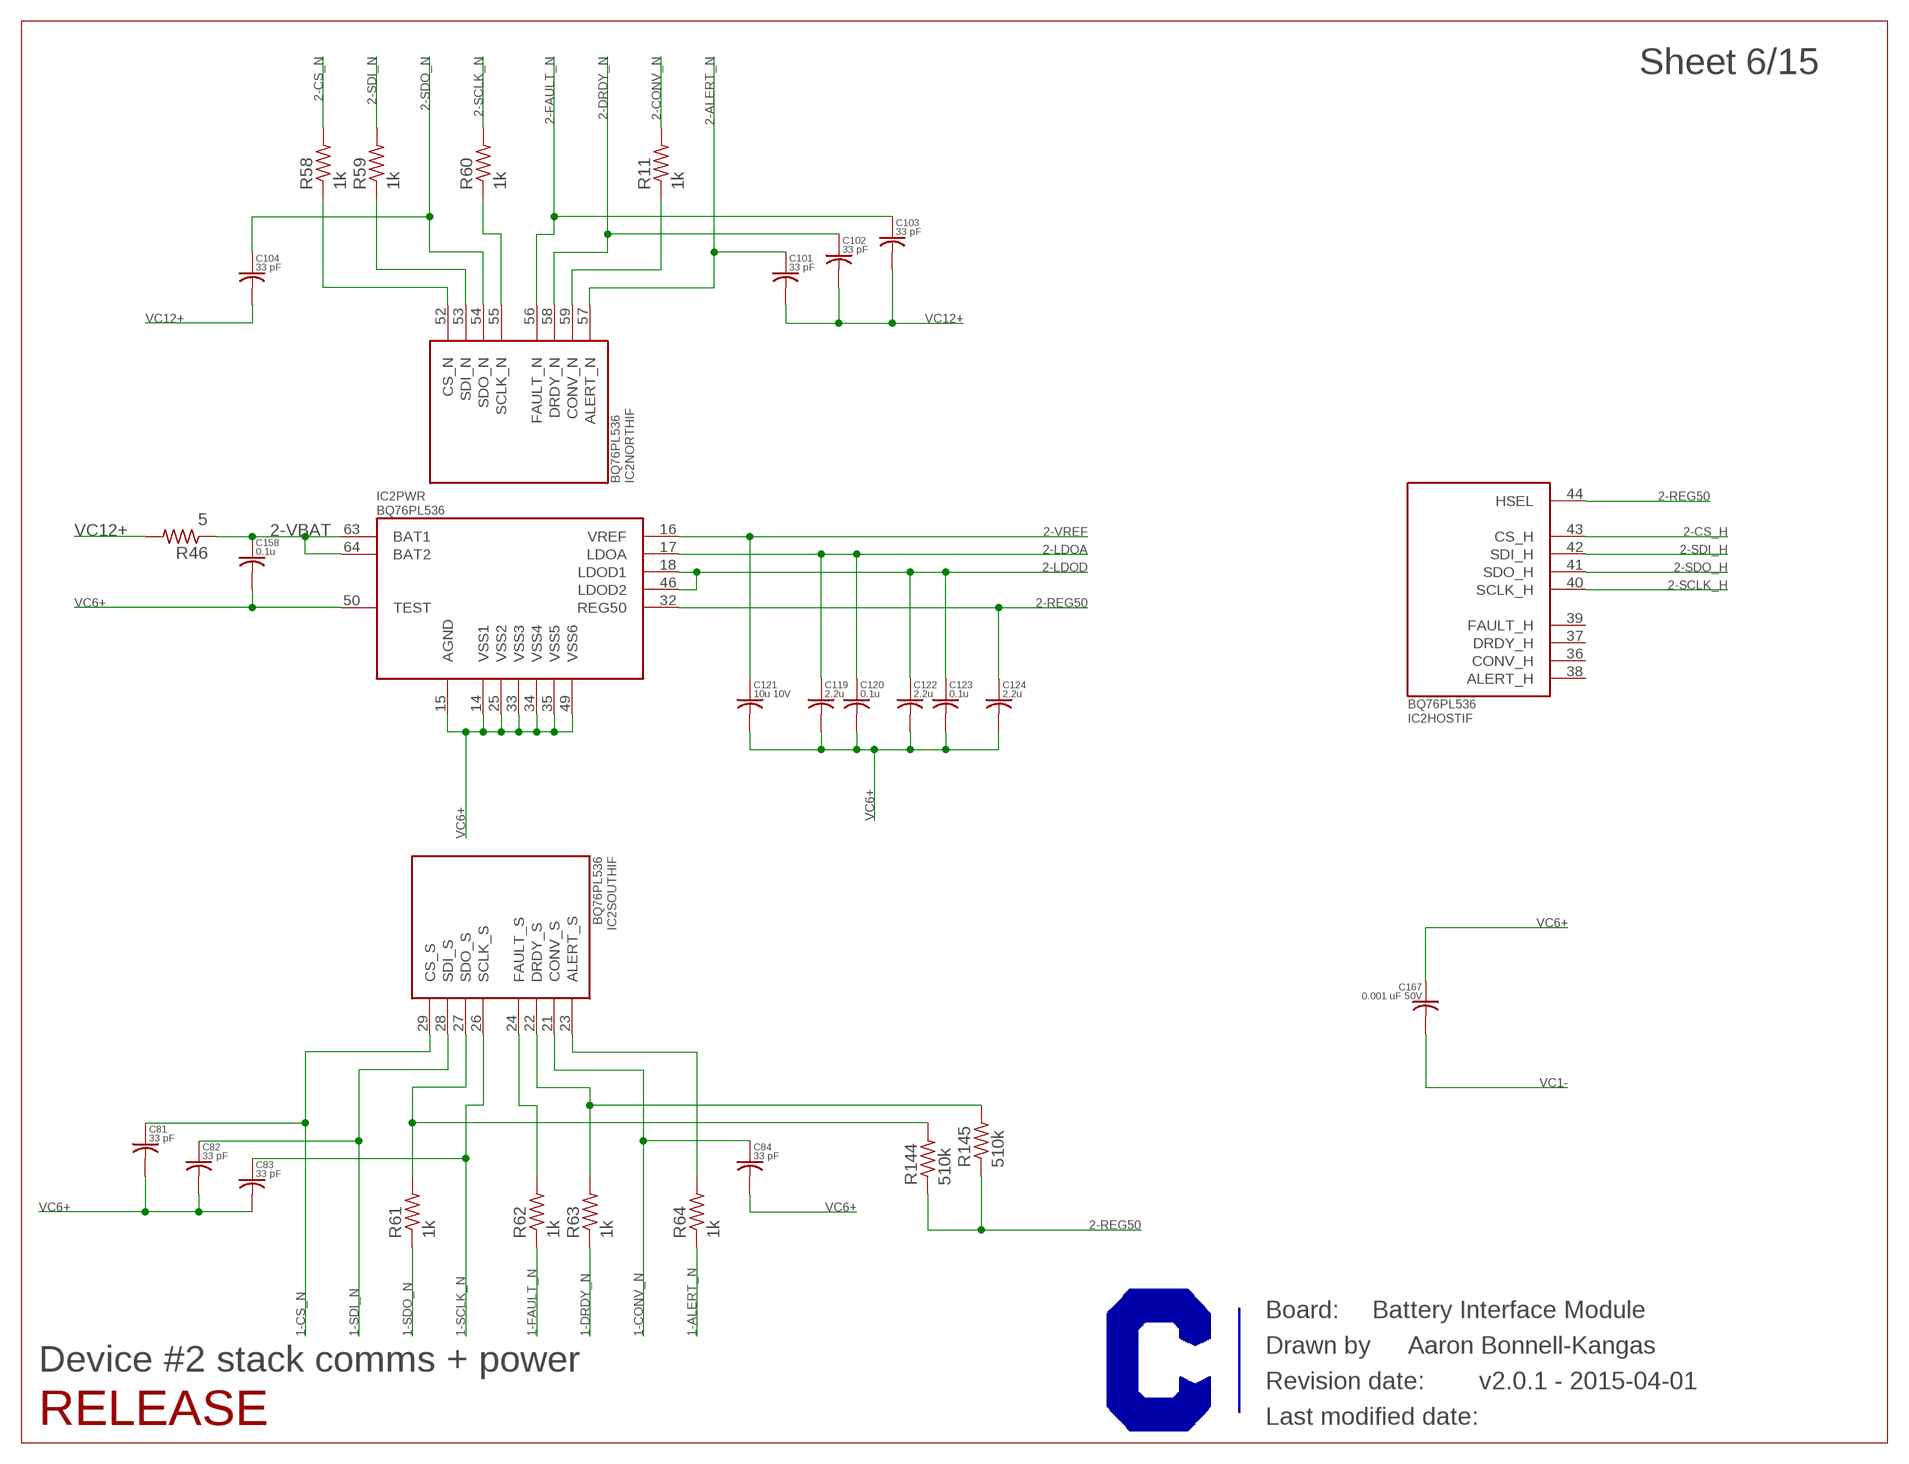
[diagram p5: schematic, sheet 6]

### Parts
C81  33 pF  C-USC0402  [C0402]
C82  33 pF  C-USC0402  [C0402]
C83  33 pF  C-USC0402  [C0402]
C84  33 pF  C-USC0402  [C0402]
C101  33 pF  C-USC0402  [C0402]
C102  33 pF  C-USC0402  [C0402]
C103  33 pF  C-USC0402  [C0402]
C104  33 pF  C-USC0402  [C0402]
C119  2.2u  C-USC0603  [C0603]
C120  0.1u  C-USC0603  [C0603]
C121  10u 10V  C-USC0805  [C0805]
C122  2.2u  C-USC0603  [C0603]
C123  0.1u  C-USC0603  [C0603]
C124  2.2u  C-USC0603  [C0603]
C158  0.1u  C-USC0603  [C0603]
C167  0.001 uF 50V  C-USC0603  [C0603]
R11  1k  R-US_R0402  [R0402]
R46  5  R-US_R0603  [R0603]
R58  1k  R-US_R0402  [R0402]
R59  1k  R-US_R0402  [R0402]
R60  1k  R-US_R0402  [R0402]
R61  1k  R-US_R0402  [R0402]
R62  1k  R-US_R0402  [R0402]
R63  1k  R-US_R0402  [R0402]
R64  1k  R-US_R0402  [R0402]
R144  510k  R-US_R0402  [R0402]
R145  510k  R-US_R0402  [R0402]

### Nets
1-ALERT_N: R64.1 ; also sheet 8
1-CONV_N: C84.1 IC2.21(SOUTHIF:CONV_S) ; also sheet 8
1-CS_N: C81.1 IC2.29(SOUTHIF:CS_S) ; also sheet 8
1-DRDY_N: R63.1 ; also sheet 8
1-FAULT_N: R62.1 ; also sheet 8
1-SCLK_N: C83.1 IC2.26(SOUTHIF:SCLK_S) ; also sheet 8
1-SDI_N: C82.1 IC2.28(SOUTHIF:SDI_S) ; also sheet 8
1-SDO_N: R61.1 ; also sheet 8
2-ALERT_N: C101.1 IC2.57(NORTHIF:ALERT_N) ; also sheet 4
2-CONV_N: R11.2 ; also sheet 4
2-CS_H: IC2.43(HOSTIF:CS_H) ; also sheet 15
2-CS_N: R58.2 ; also sheet 4
2-DRDY_N: C102.1 IC2.58(NORTHIF:DRDY_N) ; also sheet 4
2-FAULT_N: C103.1 IC2.56(NORTHIF:FAULT_N) ; also sheet 4
2-LDOA: C119.1 C120.1 IC2.17(PWR:LDOA)
2-LDOD: C122.1 C123.1 IC2.18(PWR:LDOD1) IC2.46(PWR:LDOD2)
2-REG50: C124.1 IC2.32(PWR:REG50) IC2.44(HOSTIF:HSEL) R144.1 R145.1 ; also sheet 5,9,15
2-SCLK_H: IC2.40(HOSTIF:SCLK_H) ; also sheet 15
2-SCLK_N: R60.2 ; also sheet 4
2-SDI_H: IC2.42(HOSTIF:SDI_H) ; also sheet 15
2-SDI_N: R59.2 ; also sheet 4
2-SDO_H: IC2.41(HOSTIF:SDO_H) ; also sheet 15
2-SDO_N: C104.1 IC2.54(NORTHIF:SDO_N) ; also sheet 4
2-VBAT: C158.1 IC2.63(PWR:BAT1) IC2.64(PWR:BAT2) R46.1
2-VREF: C121.1 IC2.16(PWR:VREF)
N$53: IC2.24(SOUTHIF:FAULT_S) R62.2
N$55: IC2.23(SOUTHIF:ALERT_S) R64.2
N$64: IC2.22(SOUTHIF:DRDY_S) R63.2 R145.2
N$65: IC2.27(SOUTHIF:SDO_S) R61.2 R144.2
N$242: IC2.59(NORTHIF:CONV_N) R11.1
N$245: IC2.55(NORTHIF:SCLK_N) R60.1
N$247: IC2.53(NORTHIF:SDI_N) R59.1
N$248: IC2.52(NORTHIF:CS_N) R58.1
VC1- [HV]: C167.2 ; also sheet 7,8,9,11,15
VC6+ [HV]: C81.2 C82.2 C83.2 C84.2 C119.2 C120.2 C121.2 C122.2 C123.2 C124.2 C158.2 C167.1 IC2.14(PWR:VSS1) IC2.15(PWR:AGND) IC2.25(PWR:VSS2) IC2.33(PWR:VSS3) IC2.34(PWR:VSS4) IC2.35(PWR:VSS5) IC2.49(PWR:VSS6) IC2.50(PWR:TEST) ; also sheet 4,5,7,8,9,15
VC12+ [HV]: C101.2 C102.2 C103.2 C104.2 R46.2 ; also sheet 2,3,4,5,9,15
Unconnected: IC2.36(HOSTIF:CONV_H) IC2.37(HOSTIF:DRDY_H) IC2.38(HOSTIF:ALERT_H) IC2.39(HOSTIF:FAULT_H)

### Notes on the sheet
- Device #2 stack comms + power

## Sheet 7 of 15
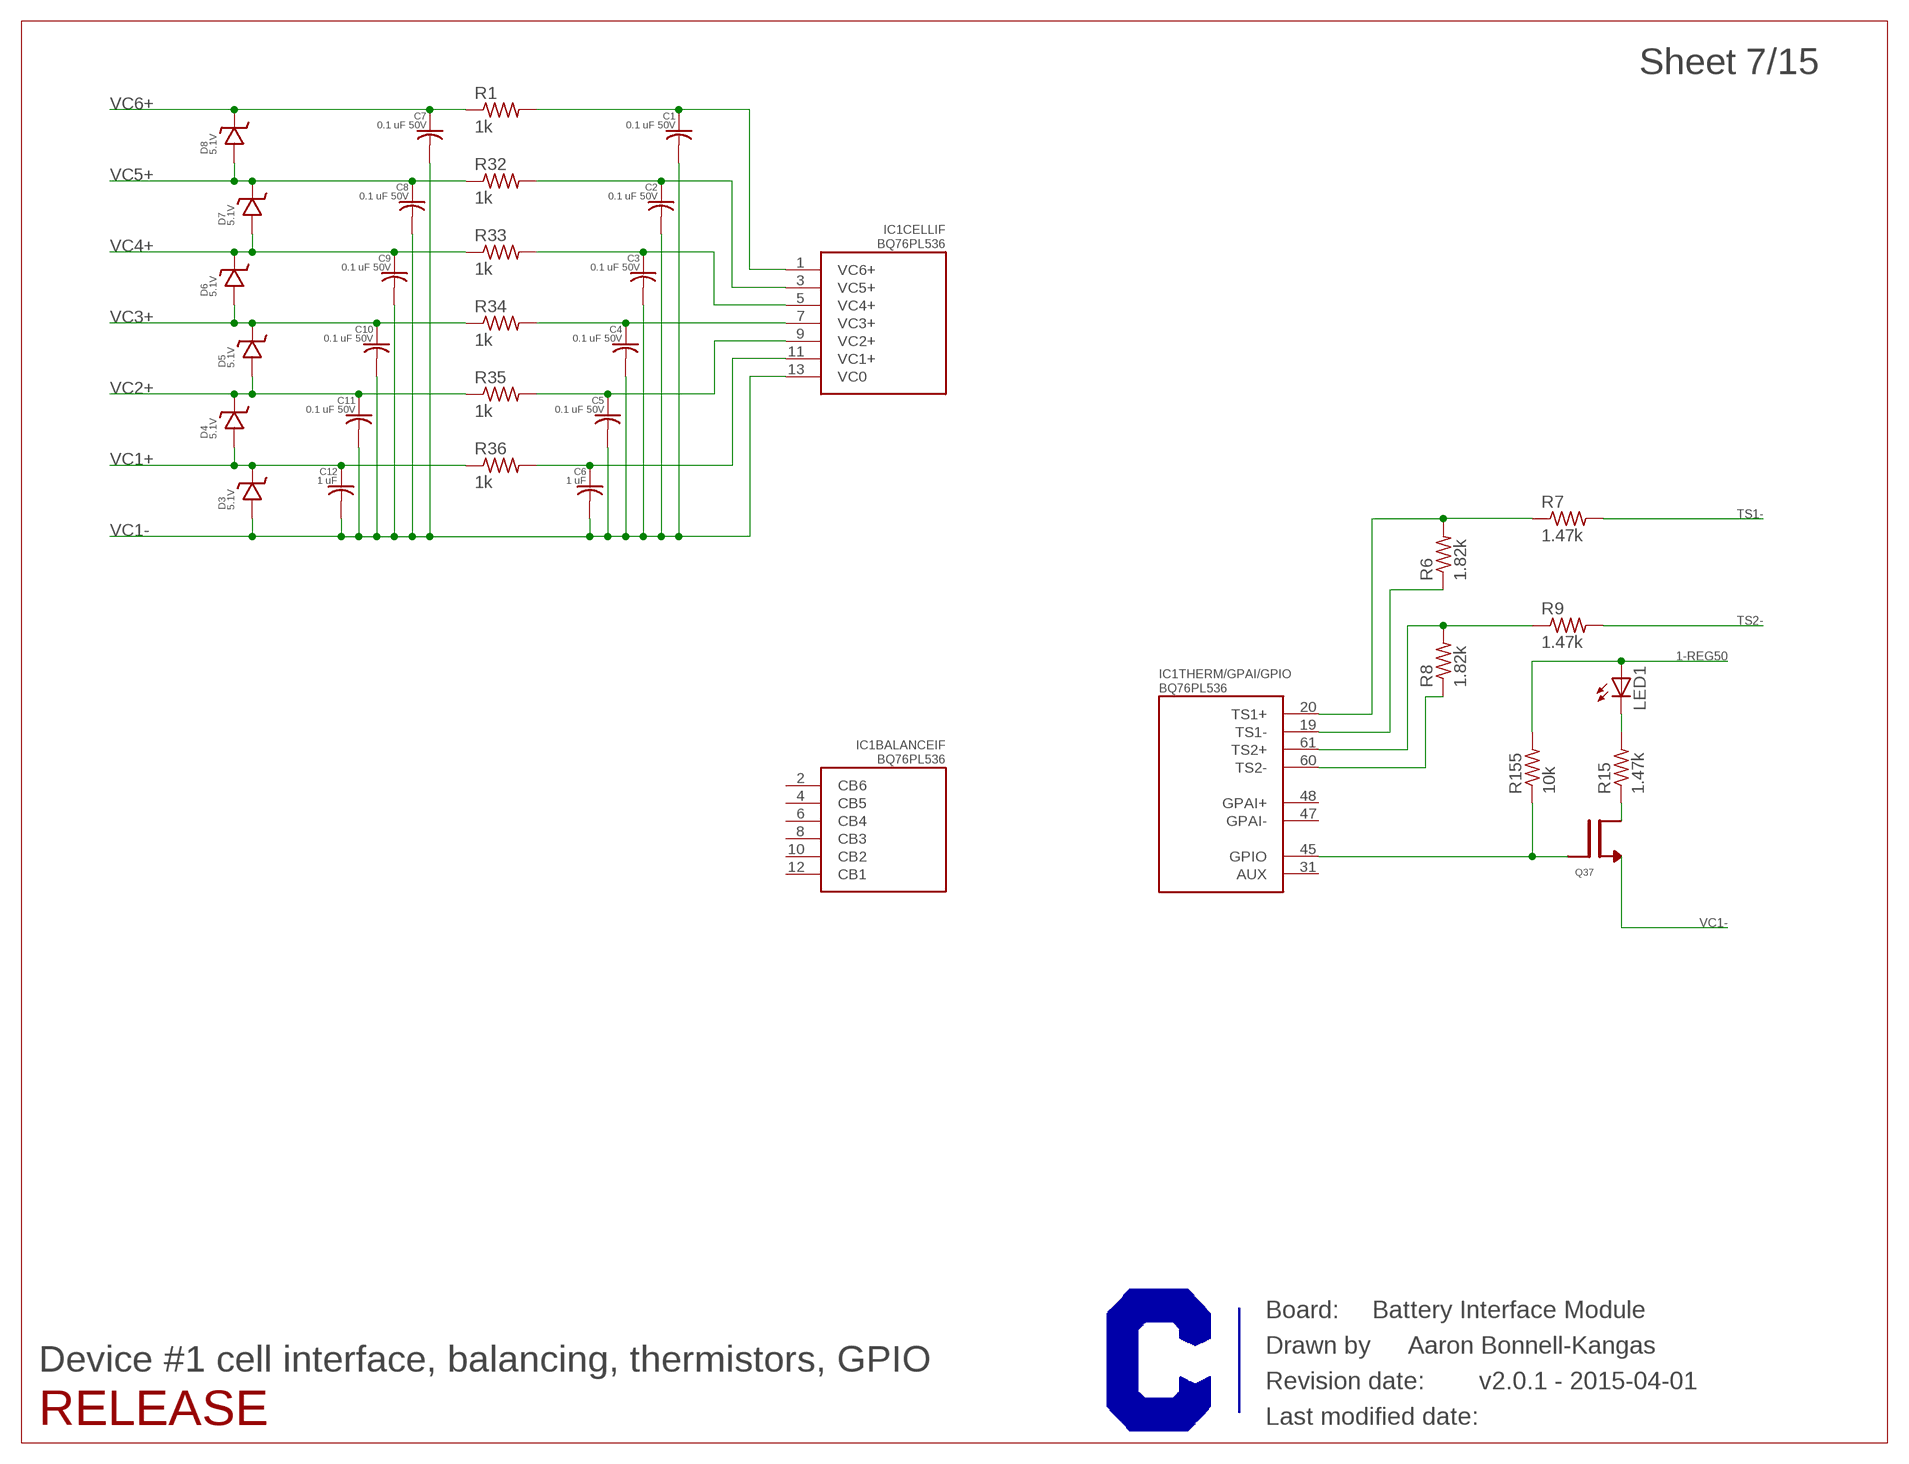
[diagram p6: schematic, sheet 7]

### Parts
C1  0.1 uF 50V  C-USC0603  [C0603]
C2  0.1 uF 50V  C-USC0603  [C0603]
C3  0.1 uF 50V  C-USC0603  [C0603]
C4  0.1 uF 50V  C-USC0603  [C0603]
C5  0.1 uF 50V  C-USC0603  [C0603]
C6  1 uF  C-USC0603  [C0603]
C7  0.1 uF 50V  C-USC0603  [C0603]
C8  0.1 uF 50V  C-USC0603  [C0603]
C9  0.1 uF 50V  C-USC0603  [C0603]
C10  0.1 uF 50V  C-USC0603  [C0603]
C11  0.1 uF 50V  C-USC0603  [C0603]
C12  1 uF  C-USC0603  [C0603]
D3  5.1V  ZENER_DIODE-SOD-323  [SOD-323]
D4  5.1V  ZENER_DIODE-SOD-323  [SOD-323]
D5  5.1V  ZENER_DIODE-SOD-323  [SOD-323]
D6  5.1V  ZENER_DIODE-SOD-323  [SOD-323]
D7  5.1V  ZENER_DIODE-SOD-323  [SOD-323]
D8  5.1V  ZENER_DIODE-SOD-323  [SOD-323]
IC1  BQ76PL536  [LQFP64-POWERPAD_(S-PQFP-G64)]
LED1  LEDCHIP-LED0603  [CHIP-LED0603]
Q37  FDN359AN  [SOT-23]
R1  1k  R-US_R0603  [R0603]
R6  1.82k  R-US_R0603  [R0603]
R7  1.47k  R-US_R0603  [R0603]
R8  1.82k  R-US_R0603  [R0603]
R9  1.47k  R-US_R0603  [R0603]
R15  1.47k  R-US_R0603  [R0603]
R32  1k  R-US_R0603  [R0603]
R33  1k  R-US_R0603  [R0603]
R34  1k  R-US_R0603  [R0603]
R35  1k  R-US_R0603  [R0603]
R36  1k  R-US_R0603  [R0603]
R155  10k  R-US_R0402  [R0402]

### Nets
1-REG50: LED1.A R155.2 ; also sheet 8,9,15
N$1: C1.1 IC1.1(CELLIF:VC6+) R1.2
N$2: C6.1 IC1.11(CELLIF:VC1+) R36.2
N$3: C3.1 IC1.5(CELLIF:VC4+) R33.2
N$5: C5.1 IC1.9(CELLIF:VC2+) R35.2
N$9: IC1.19(THERM/GPAI/GPIO:TS1-) R6.1
N$10: IC1.20(THERM/GPAI/GPIO:TS1+) R6.2 R7.1
N$11: IC1.61(THERM/GPAI/GPIO:TS2+) R8.2 R9.1
N$12: IC1.60(THERM/GPAI/GPIO:TS2-) R8.1
N$23: Q37.3(DRAIN) R15.1
N$25: LED1.C R15.2
N$26: IC1.45(THERM/GPAI/GPIO:GPIO) Q37.1(GATE) R155.1
N$58: C2.1 IC1.3(CELLIF:VC5+) R32.2
N$59: C4.1 IC1.7(CELLIF:VC3+) R34.2
TS1-: R7.2 ; also sheet 9
TS2-: R9.2 ; also sheet 9
VC1+: C12.1 D3.CATHODE D4.ANODE R36.1 ; also sheet 9
VC1- [HV]: C1.2 C2.2 C3.2 C4.2 C5.2 C6.2 C7.2 C8.2 C9.2 C10.2 C11.2 C12.2 D3.ANODE IC1.13(CELLIF:VC0) Q37.2(SOURCE) ; also sheet 6,8,9,11,15
VC2+: C11.1 D4.CATHODE D5.ANODE R35.1 ; also sheet 9
VC3+: C10.1 D5.CATHODE D6.ANODE R34.1 ; also sheet 9
VC4+: C9.1 D6.CATHODE D7.ANODE R33.1 ; also sheet 9
VC5+: C8.1 D7.CATHODE D8.ANODE R32.1 ; also sheet 9
VC6+ [HV]: C7.1 D8.CATHODE R1.1 ; also sheet 4,5,6,8,9,15
Unconnected: IC1.2(BALANCEIF:CB6) IC1.4(BALANCEIF:CB5) IC1.6(BALANCEIF:CB4) IC1.8(BALANCEIF:CB3) IC1.10(BALANCEIF:CB2) IC1.12(BALANCEIF:CB1) IC1.31(THERM/GPAI/GPIO:AUX) IC1.47(THERM/GPAI/GPIO:GPAI-) IC1.48(THERM/GPAI/GPIO:GPAI+)

### Notes on the sheet
- Device #1 cell interface, balancing, thermistors, GPIO

## Sheet 8 of 15
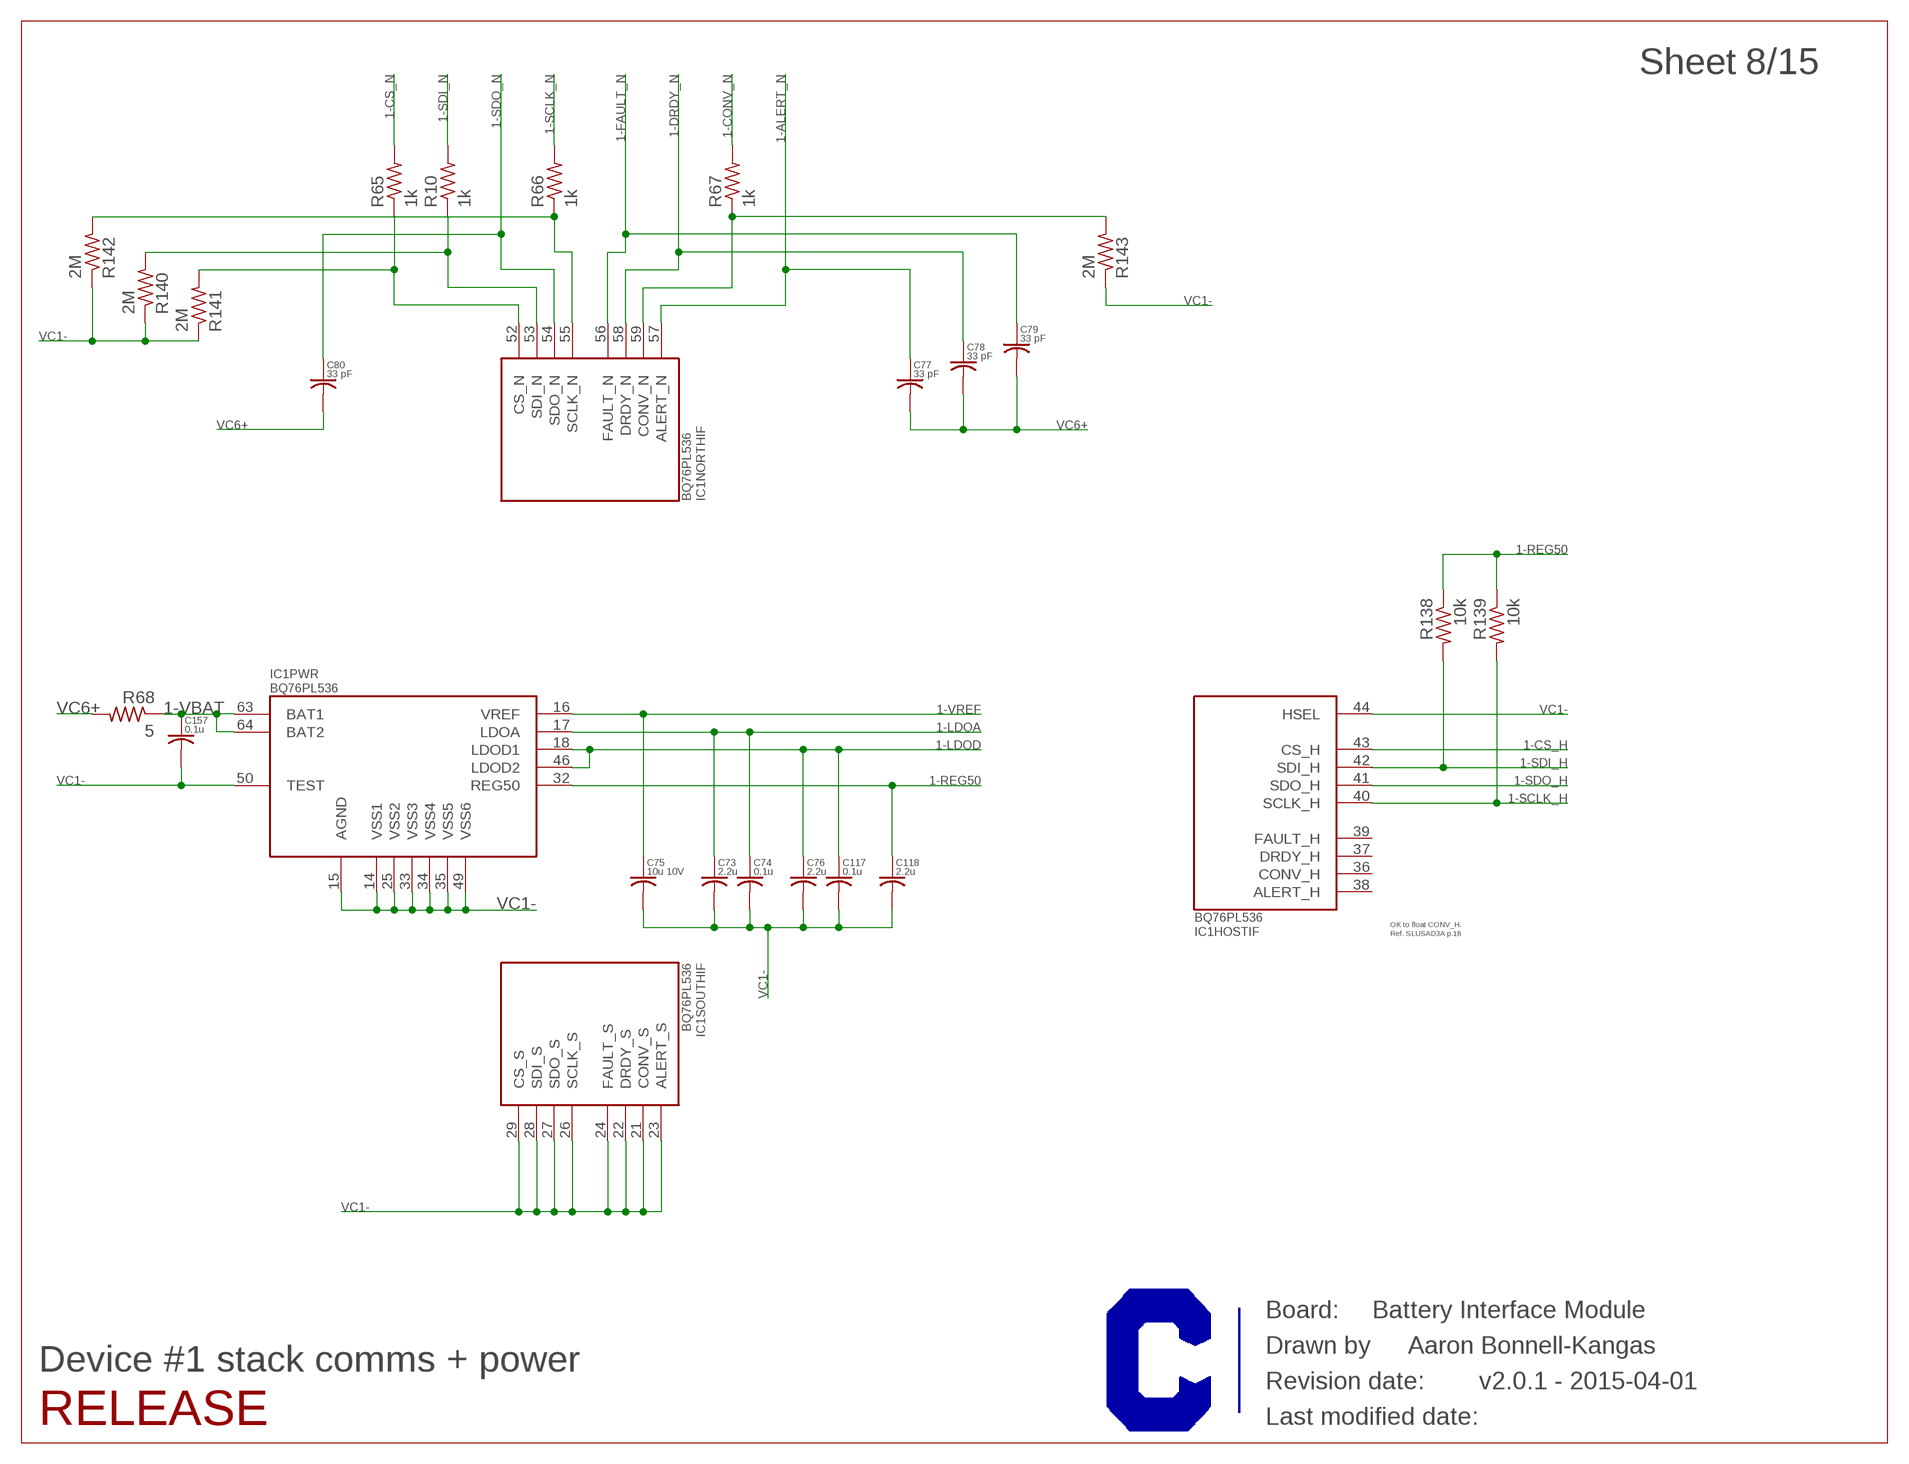
[diagram p7: schematic, sheet 8]

### Parts
C73  2.2u  C-USC0603  [C0603]
C74  0.1u  C-USC0603  [C0603]
C75  10u 10V  C-USC0805  [C0805]
C76  2.2u  C-USC0603  [C0603]
C77  33 pF  C-USC0402  [C0402]
C78  33 pF  C-USC0402  [C0402]
C79  33 pF  C-USC0402  [C0402]
C80  33 pF  C-USC0402  [C0402]
C117  0.1u  C-USC0603  [C0603]
C118  2.2u  C-USC0603  [C0603]
C157  0.1u  C-USC0603  [C0603]
R10  1k  R-US_R0402  [R0402]
R65  1k  R-US_R0402  [R0402]
R66  1k  R-US_R0402  [R0402]
R67  1k  R-US_R0402  [R0402]
R68  5  R-US_R0603  [R0603]
R138  10k  R-US_R0603  [R0603]
R139  10k  R-US_R0603  [R0603]
R140  2M  R-US_R0402  [R0402]
R141  2M  R-US_R0402  [R0402]
R142  2M  R-US_R0402  [R0402]
R143  2M  R-US_R0402  [R0402]

### Nets
1-ALERT_N: C77.1 IC1.57(NORTHIF:ALERT_N) ; also sheet 6
1-CONV_N: R67.2 ; also sheet 6
1-CS_H: IC1.43(HOSTIF:CS_H) ; also sheet 11,15
1-CS_N: R65.2 ; also sheet 6
1-DRDY_N: C78.1 IC1.58(NORTHIF:DRDY_N) ; also sheet 6
1-FAULT_N: C79.1 IC1.56(NORTHIF:FAULT_N) ; also sheet 6
1-LDOA: C73.1 C74.1 IC1.17(PWR:LDOA)
1-LDOD: C76.1 C117.1 IC1.18(PWR:LDOD1) IC1.46(PWR:LDOD2)
1-REG50: C118.1 IC1.32(PWR:REG50) R138.1 R139.1 ; also sheet 7,9,15
1-SCLK_H: IC1.40(HOSTIF:SCLK_H) R139.2 ; also sheet 11,15
1-SCLK_N: R66.2 ; also sheet 6
1-SDI_H: IC1.42(HOSTIF:SDI_H) R138.2 ; also sheet 11,15
1-SDI_N: R10.2 ; also sheet 6
1-SDO_H: IC1.41(HOSTIF:SDO_H) ; also sheet 11,15
1-SDO_N: C80.1 IC1.54(NORTHIF:SDO_N) ; also sheet 6
1-VBAT: C157.1 IC1.63(PWR:BAT1) IC1.64(PWR:BAT2) R68.1
1-VREF: C75.1 IC1.16(PWR:VREF)
N$24: IC1.59(NORTHIF:CONV_N) R67.1 R143.2
N$27: IC1.55(NORTHIF:SCLK_N) R66.1 R142.2
N$36: IC1.53(NORTHIF:SDI_N) R10.1 R140.2
N$37: IC1.52(NORTHIF:CS_N) R65.1 R141.2
VC1- [HV]: C73.2 C74.2 C75.2 C76.2 C117.2 C118.2 C157.2 IC1.14(PWR:VSS1) IC1.15(PWR:AGND) IC1.21(SOUTHIF:CONV_S) IC1.22(SOUTHIF:DRDY_S) IC1.23(SOUTHIF:ALERT_S) IC1.24(SOUTHIF:FAULT_S) IC1.25(PWR:VSS2) IC1.26(SOUTHIF:SCLK_S) IC1.27(SOUTHIF:SDO_S) IC1.28(SOUTHIF:SDI_S) IC1.29(SOUTHIF:CS_S) IC1.33(PWR:VSS3) IC1.34(PWR:VSS4) IC1.35(PWR:VSS5) IC1.44(HOSTIF:HSEL) IC1.49(PWR:VSS6) IC1.50(PWR:TEST) R140.1 R141.1 R142.1 R143.1 ; also sheet 6,7,9,11,15
VC6+ [HV]: C77.2 C78.2 C79.2 C80.2 R68.2 ; also sheet 4,5,6,7,9,15
Unconnected: IC1.36(HOSTIF:CONV_H) IC1.37(HOSTIF:DRDY_H) IC1.38(HOSTIF:ALERT_H) IC1.39(HOSTIF:FAULT_H)

### Notes on the sheet
- OK to float CONV_H.
- Ref. SLUSAD3A p.18
- Device #1 stack comms + power

## Sheet 9 of 15
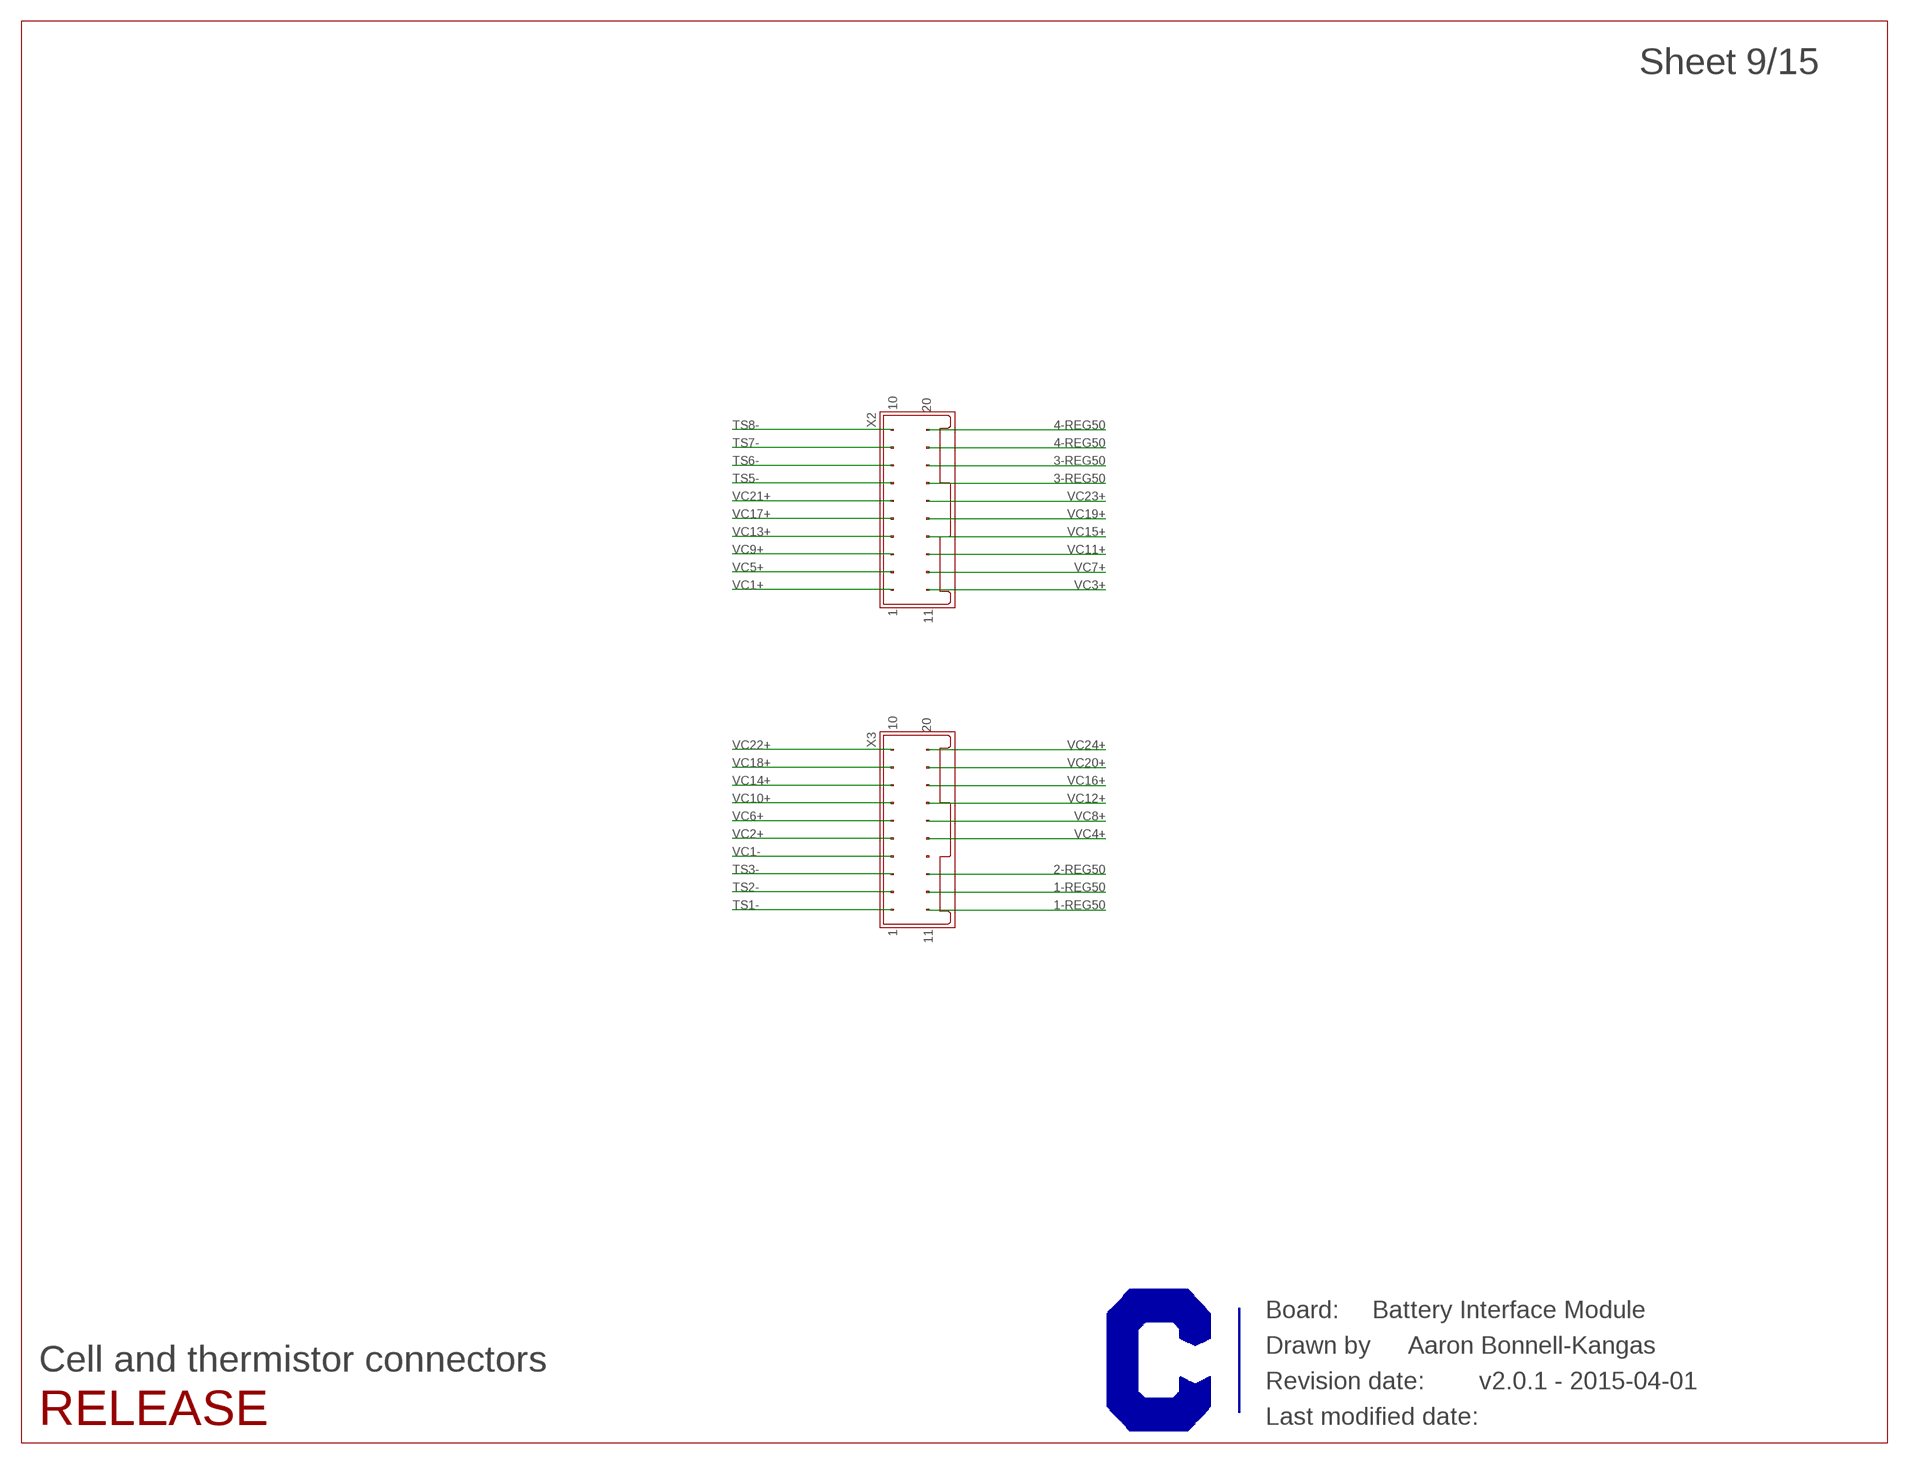
[diagram p8: schematic, sheet 9]

### Parts
X2  MICROCLASP-20-DUAL-RA  [MICROCLASP-20-DUAL-RA]
X3  MICROCLASP-20-DUAL-RA  [MICROCLASP-20-DUAL-RA]

### Nets
1-REG50: X3.11 X3.12 ; also sheet 7,8,15
2-REG50: X3.13 ; also sheet 5,6,15
3-REG50: X2.17 X2.18 ; also sheet 3,4,15
4-REG50: X2.19 X2.20 ; also sheet 1,2,15
TS1-: X3.1 ; also sheet 7
TS2-: X3.2 ; also sheet 7
TS3-: X3.3 ; also sheet 5
TS5-: X2.7 ; also sheet 3
TS6-: X2.8 ; also sheet 3
TS7-: X2.9 ; also sheet 1
TS8-: X2.10 ; also sheet 1
VC1+: X2.1 ; also sheet 7
VC1- [HV]: X3.4 ; also sheet 6,7,8,11,15
VC2+: X3.5 ; also sheet 7
VC3+: X2.11 ; also sheet 7
VC4+: X3.15 ; also sheet 7
VC5+: X2.2 ; also sheet 7
VC6+ [HV]: X3.6 ; also sheet 4,5,6,7,8,15
VC7+: X2.12 ; also sheet 5
VC8+: X3.16 ; also sheet 5
VC9+: X2.3 ; also sheet 5
VC10+: X3.7 ; also sheet 5
VC11+: X2.13 ; also sheet 5
VC12+ [HV]: X3.17 ; also sheet 2,3,4,5,6,15
VC13+: X2.4 ; also sheet 3
VC14+: X3.8 ; also sheet 3
VC15+: X2.14 ; also sheet 3
VC16+: X3.18 ; also sheet 3
VC17+: X2.5 ; also sheet 3
VC18+ [HV]: X3.9 ; also sheet 1,2,3,4
VC19+: X2.15 ; also sheet 1
VC20+: X3.19 ; also sheet 1
VC21+: X2.6 ; also sheet 1
VC22+: X3.10 ; also sheet 1
VC23+: X2.16 ; also sheet 1
VC24+ [HV]: X3.20 ; also sheet 1,2,15
Unconnected: X3.14

### Notes on the sheet
- Cell and thermistor connectors

## Sheet 10 of 15
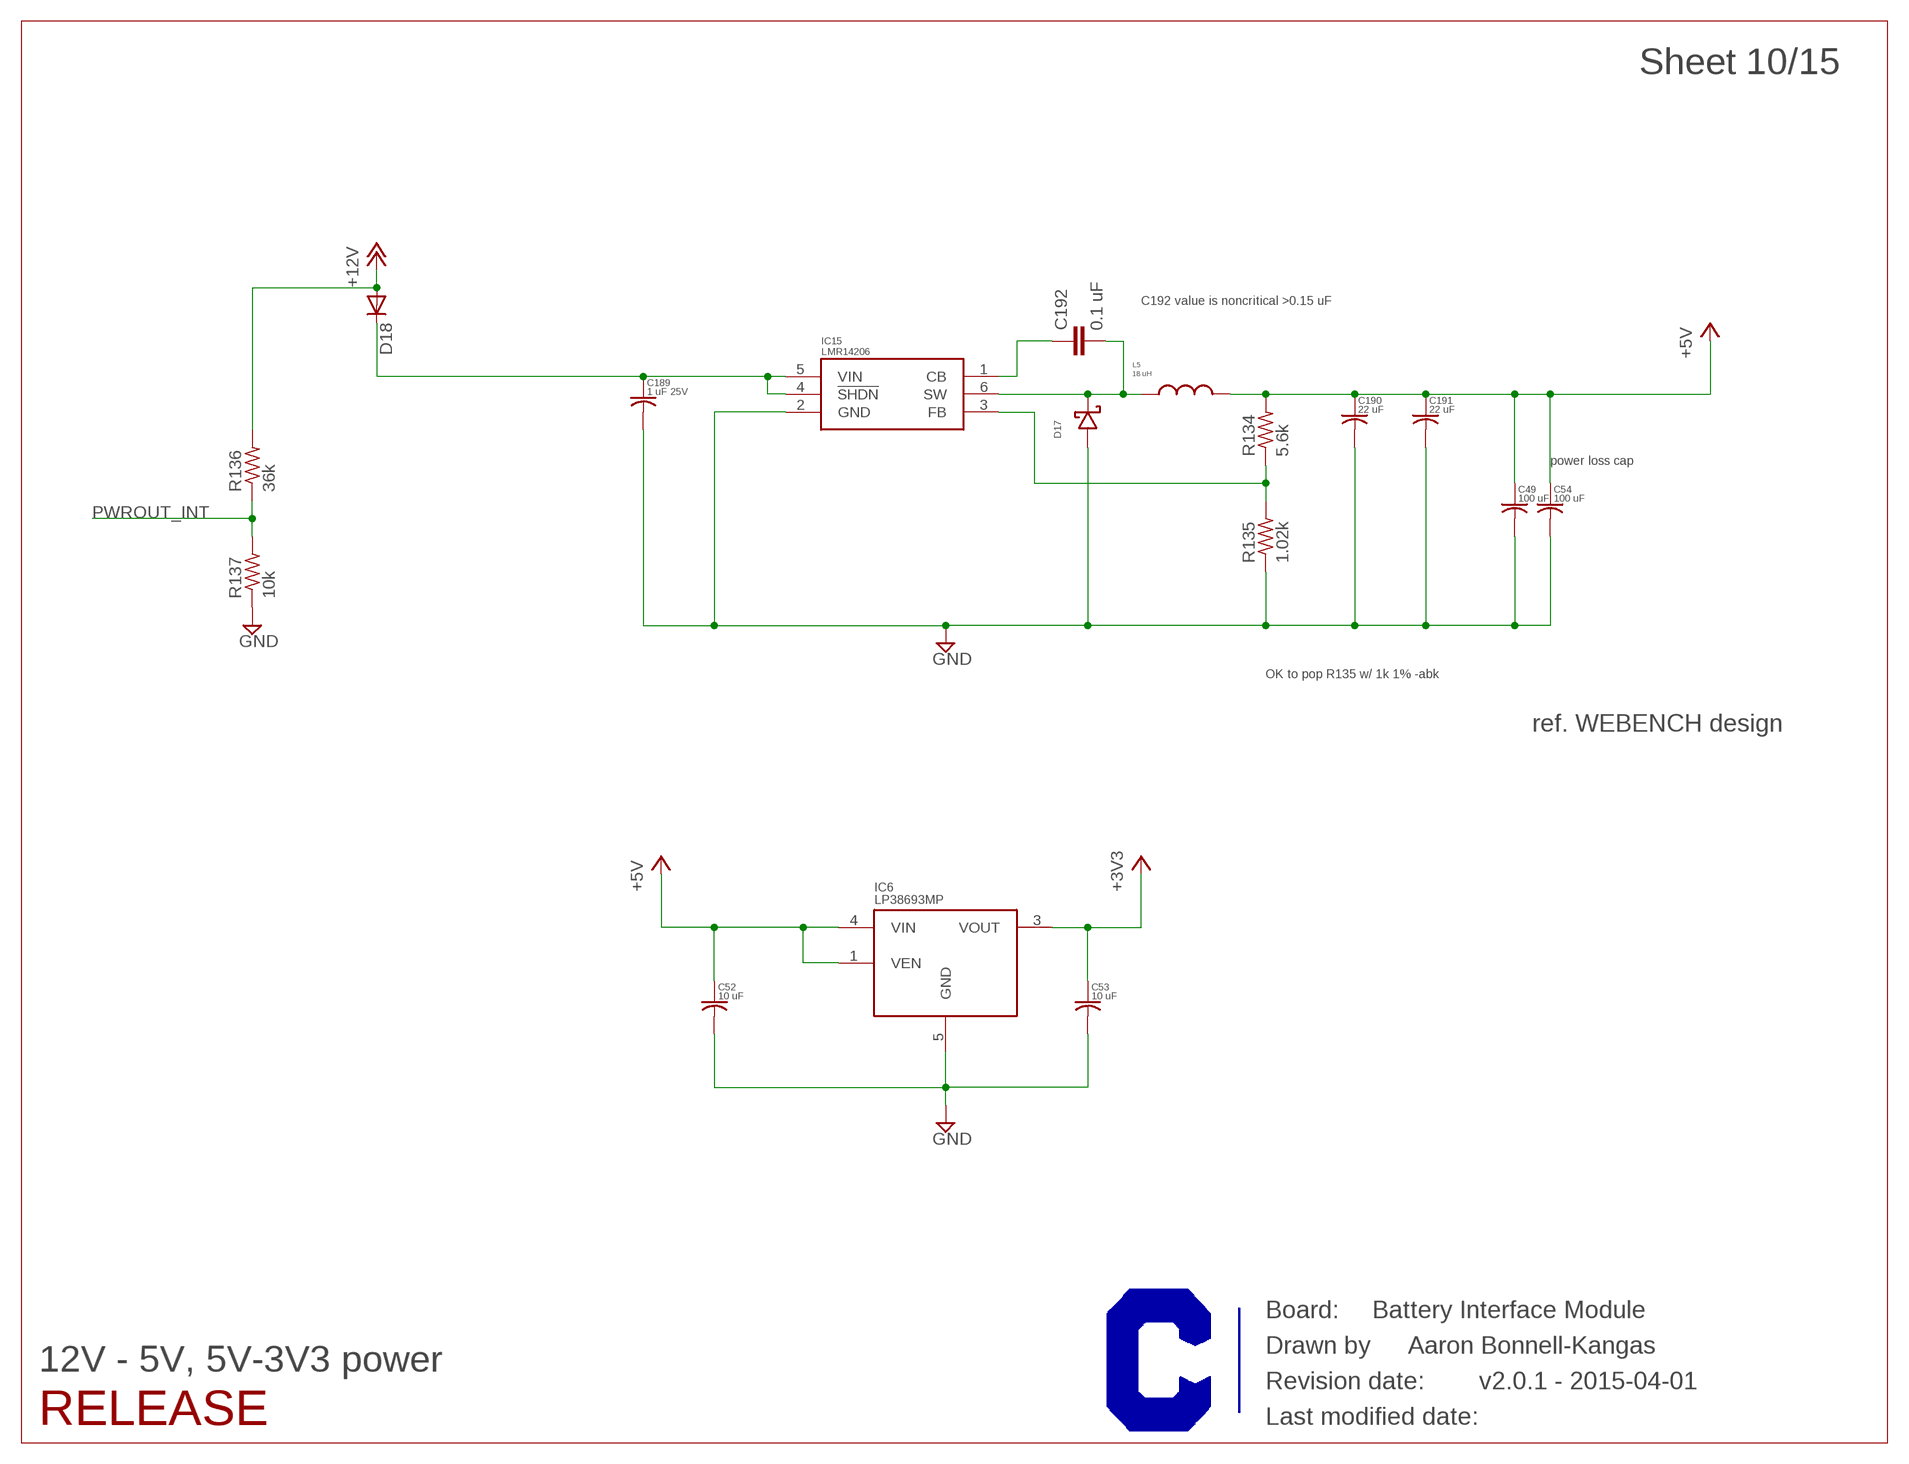
[diagram p9: schematic, sheet 10]

### Parts
C49  100 uF  C-USC1210  [C1210]
C52  10 uF  C-USC0603  [C0603]
C53  10 uF  C-USC0603  [C0603]
C54  100 uF  C-USC1210  [C1210]
C189  1 uF 25V  C-USC1206  [C1206]
C190  22 uF  C-USC0805  [C0805]
C191  22 uF  C-USC0805  [C0805]
C192  0.1 uF  C-EUC0603  [C0603]
D17  SCHOTTKY_DIODE-SMA  [SMA]
D18  DIODE-SOD123  [SOD123]
IC6  LP38693MP  [SOT-223-5]
IC15  LMR14206  [SOT-6_DDC]
L5  18 uH  SDR0604  [SDR0604]
R134  5.6k  R-US_R0603  [R0603]
R135  1.02k  R-US_R0603  [R0603]
R136  36k  R-US_R0603  [R0603]
R137  10k  R-US_R0603  [R0603]

### Nets
+3V3 [LV]: C53.1 IC6.3(VOUT) ; also sheet 11,12,14,15
+5V: C49.1 C52.1 C54.1 C190.1 C191.1 IC6.1(VEN) IC6.4(VIN) L5.P$2 R134.2 ; also sheet 13,15
+12V: D18.A R136.2 ; also sheet 13,15
GND [LV]: C49.2 C52.2 C53.2 C54.2 C189.2 C190.2 C191.2 D17.ANODE IC6.5(GND) IC15.2(GND) R135.1 R137.1 ; also sheet 11,12,13,14,15
N$112: C192.2 D17.CATHODE IC15.6(SW) L5.P$1
N$156: IC15.3(FB) R134.1 R135.2
N$159: C189.1 D18.C IC15.4(!SHDN) IC15.5(VIN)
N$168: C192.1 IC15.1(CB)
PWROUT_INT: R136.1 R137.2 ; also sheet 12

### Notes on the sheet
- C192 value is noncritical >0.15 uF
- power loss cap
- OK to pop R135 w/ 1k 1% -abk
- ref. WEBENCH design
- 12V - 5V, 5V-3V3 power

## Sheet 11 of 15
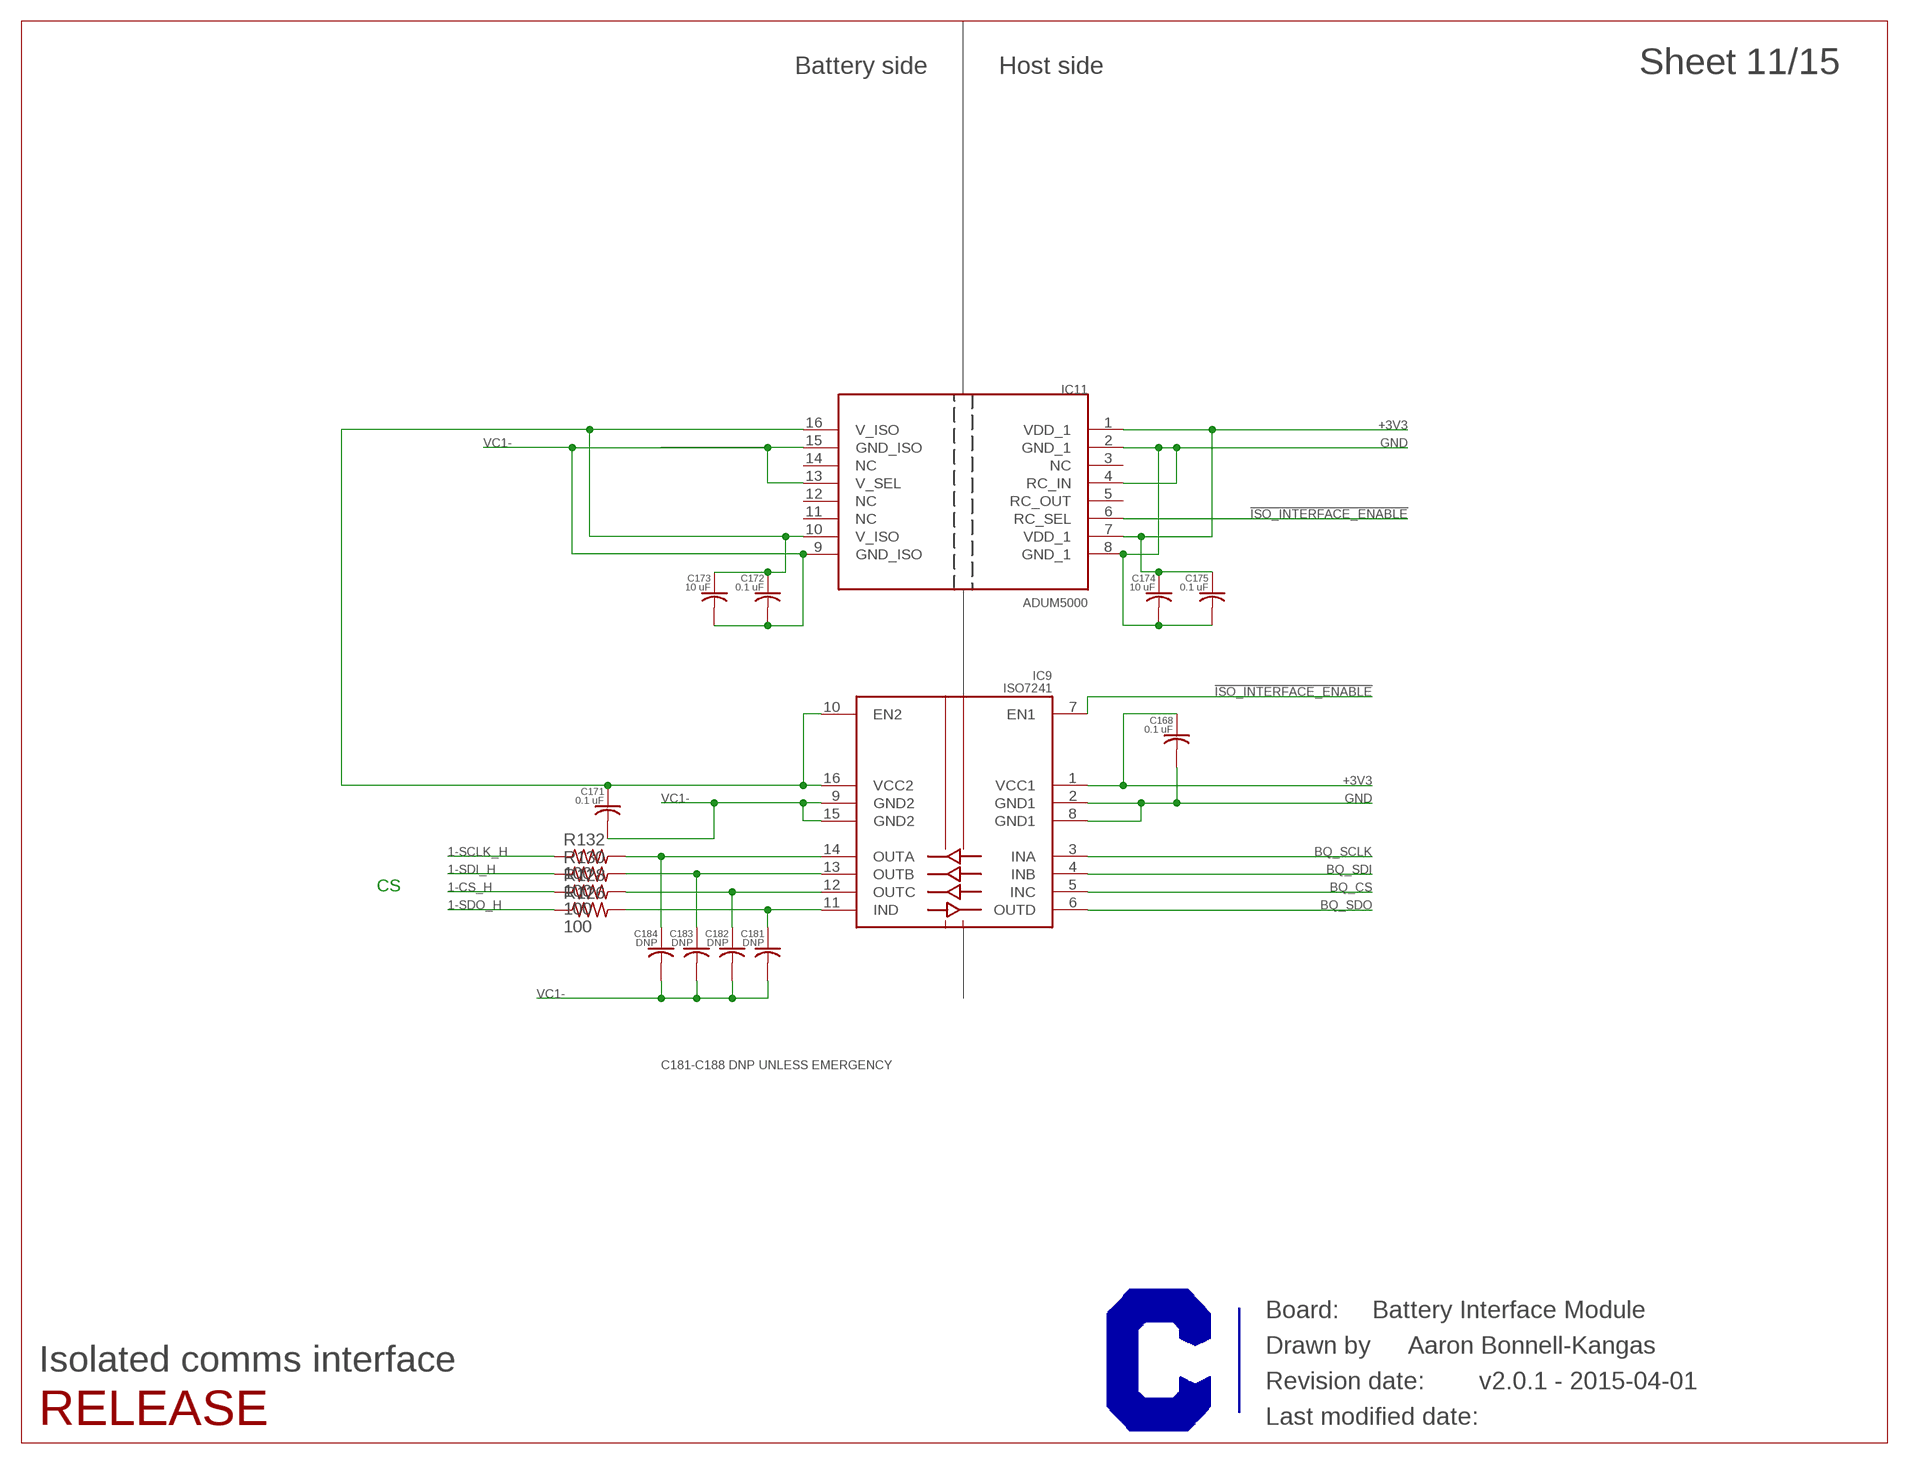
[diagram p10: schematic, sheet 11]

### Parts
C168  0.1 uF  C-USC0603  [C0603]
C171  0.1 uF  C-USC0603  [C0603]
C172  0.1 uF  C-USC0603  [C0603]
C173  10 uF  C-USC0603  [C0603]
C174  10 uF  C-USC0603  [C0603]
C175  0.1 uF  C-USC0603  [C0603]
C181  DNP  C-USC0603  [C0603]
C182  DNP  C-USC0603  [C0603]
C183  DNP  C-USC0603  [C0603]
C184  DNP  C-USC0603  [C0603]
IC9  ISO7241  [D_(R-PDSO-G16)]
IC11  ADUM5000  [SO-16W]
R126  100  R-US_R0603  [R0603]
R128  100  R-US_R0603  [R0603]
R130  100  R-US_R0603  [R0603]
R132  100  R-US_R0603  [R0603]

### Nets
1-CS_H: R128.1 ; also sheet 8,15
1-SCLK_H: R132.1 ; also sheet 8,15
1-SDI_H: R130.1 ; also sheet 8,15
1-SDO_H: R126.1 ; also sheet 8,15
!ISO_INTERFACE_ENABLE: IC9.7(EN1) IC11.6(RC_SEL) ; also sheet 12
+3V3 [LV]: C168.1 C174.1 C175.1 IC9.1(VCC1) IC11.1(VDD_1) IC11.7(VDD_1) ; also sheet 10,12,14,15
+3V3_ISO: C171.1 C172.1 C173.1 IC9.10(EN2) IC9.16(VCC2) IC11.10(V_ISO) IC11.16(V_ISO)
BQ_CS: IC9.5(INC) ; also sheet 12,15
BQ_SCLK: IC9.3(INA) ; also sheet 12,15
BQ_SDI: IC9.4(INB) ; also sheet 12,15
BQ_SDO: IC9.6(OUTD) ; also sheet 12,15
GND [LV]: C168.2 C174.2 C175.2 IC9.2(GND1) IC9.8(GND1) IC11.2(GND_1) IC11.4(RC_IN) IC11.8(GND_1) ; also sheet 10,12,13,14,15
N$140: C184.1 IC9.14(OUTA) R132.2
N$149: C183.1 IC9.13(OUTB) R130.2
N$150: C182.1 IC9.12(OUTC) R128.2
N$151: C181.1 IC9.11(IND) R126.2
VC1- [HV]: C171.2 C172.2 C173.2 C181.2 C182.2 C183.2 C184.2 IC9.9(GND2) IC9.15(GND2) IC11.9(GND_ISO) IC11.13(V_SEL) IC11.15(GND_ISO) ; also sheet 6,7,8,9,15
Unconnected: IC11.3(NC) IC11.5(RC_OUT) IC11.11(NC) IC11.12(NC) IC11.14(NC)

### Notes on the sheet
- Battery side | Host side
- CS
- C181-C188 DNP UNLESS EMERGENCY
- Isolated comms interface

## Sheet 12 of 15
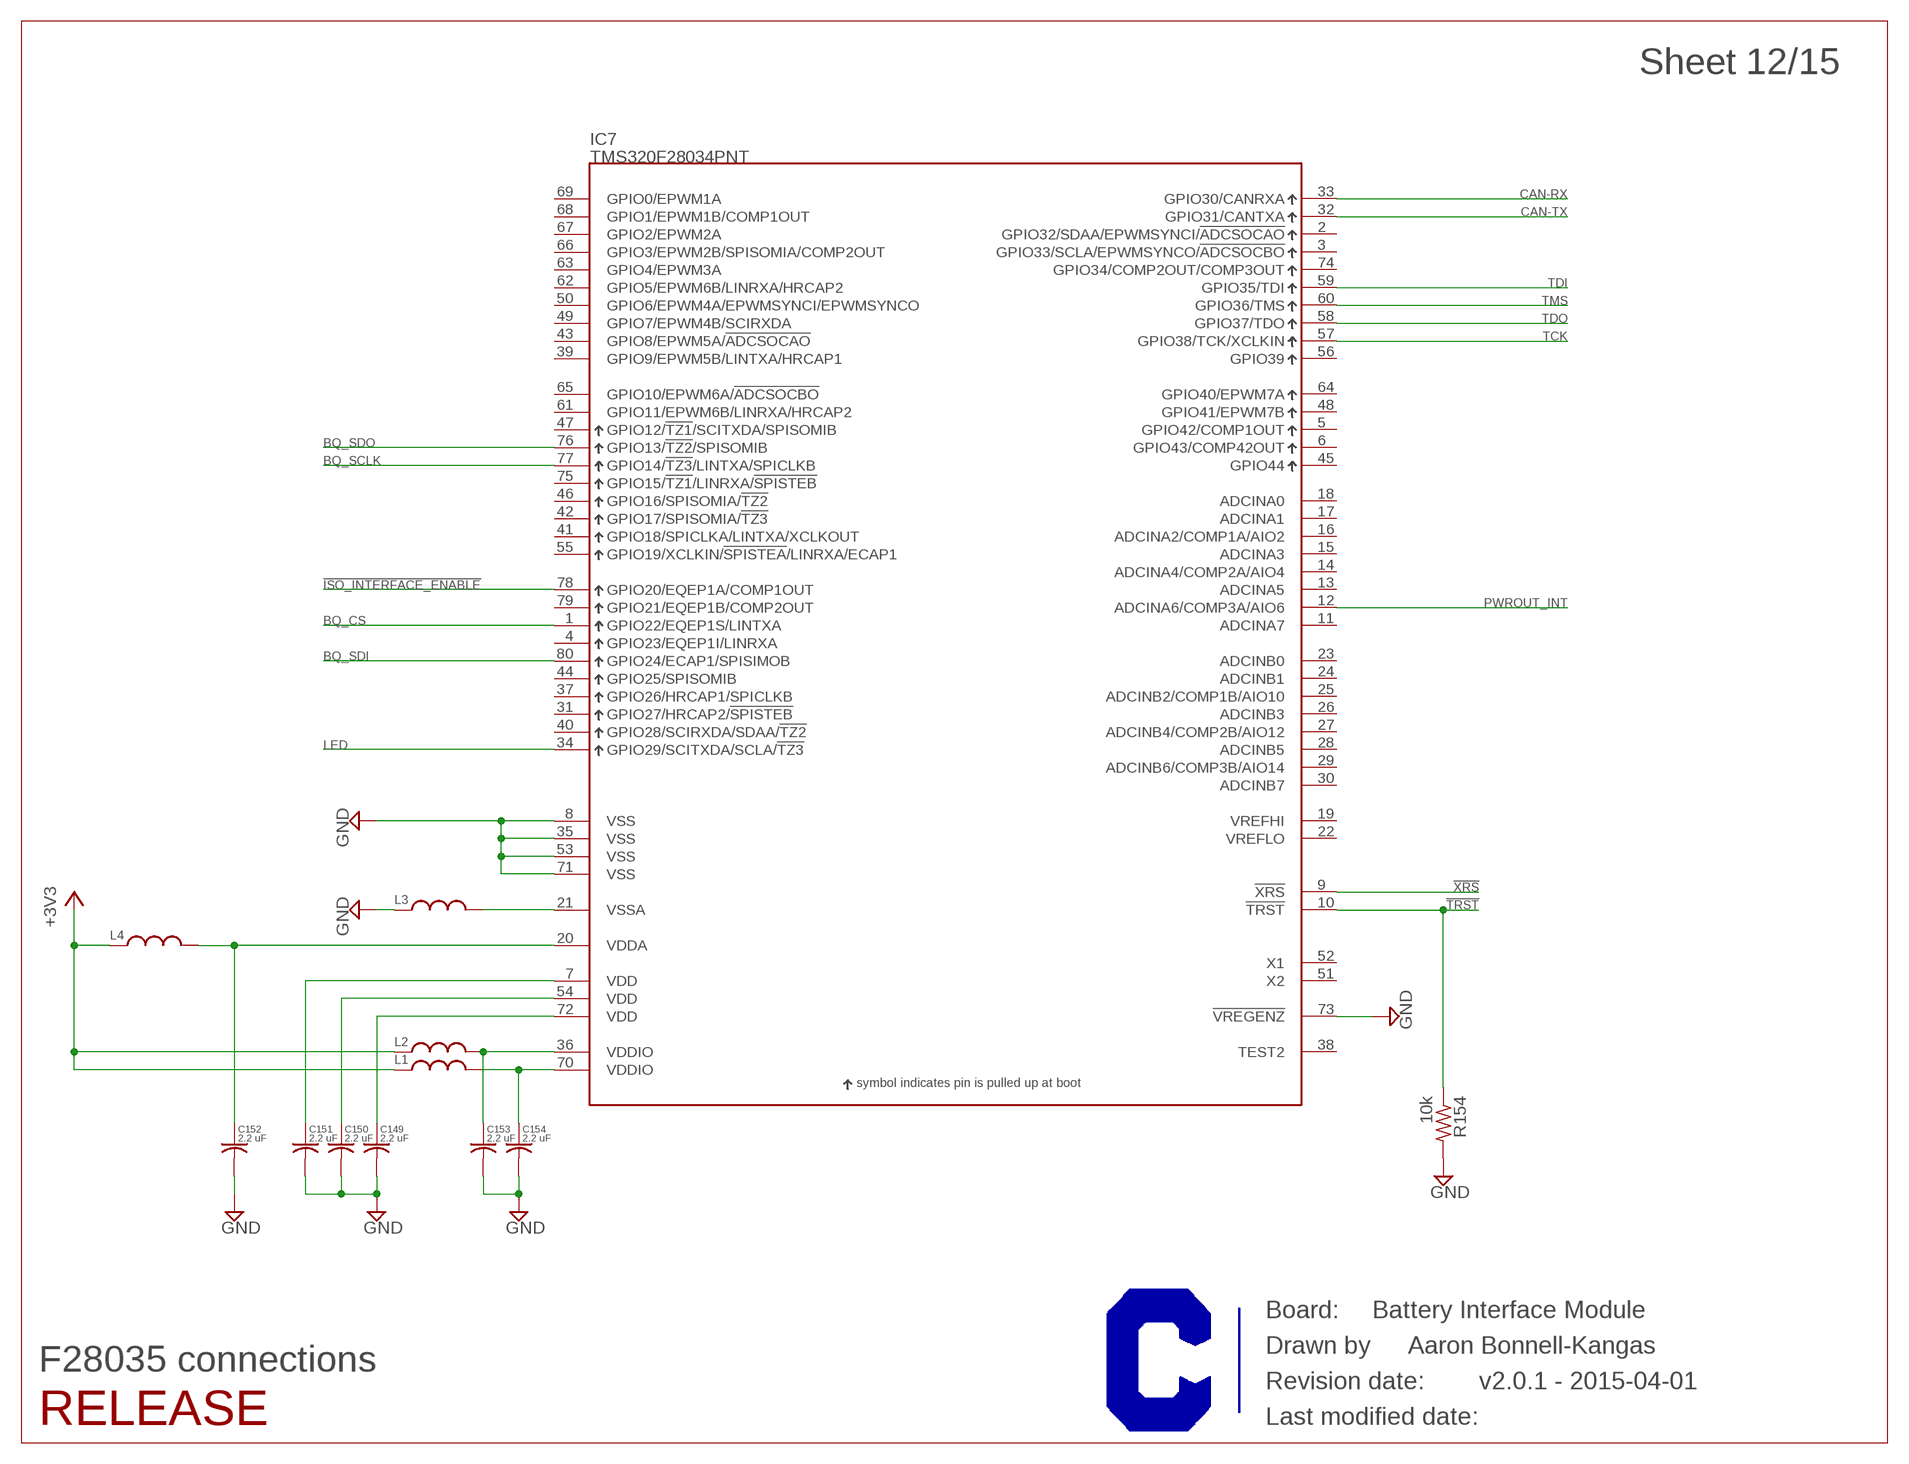
[diagram p11: schematic, sheet 12]

### Parts
C149  2.2 uF  C-USC0603  [C0603]
C150  2.2 uF  C-USC0603  [C0603]
C151  2.2 uF  C-USC0603  [C0603]
C152  2.2 uF  C-USC0603  [C0603]
C153  2.2 uF  C-USC0603  [C0603]
C154  2.2 uF  C-USC0603  [C0603]
IC7  TMS320F28034PNT  [PQFP-80_(S-PQFP-G80)]
L1  INDUCTOR  [0603]
L2  INDUCTOR  [0603]
L3  INDUCTOR  [0603]
L4  INDUCTOR  [0603]
R154  10k  R-US_R0603  [R0603]

### Nets
!ISO_INTERFACE_ENABLE: IC7.78(GPIO20/EQEP1A/COMP1OUT) ; also sheet 11
!TRST: IC7.10(!TRST) R154.1 ; also sheet 14
!XRS: IC7.9(!XRS)
+3V3 [LV]: L1.A L2.A L4.A ; also sheet 10,11,14,15
BQ_CS: IC7.1(GPIO22/EQEP1S/LINTXA) ; also sheet 11,15
BQ_SCLK: IC7.77(GPIO14/!TZ3!/LINTXA/SPICLKB) ; also sheet 11,15
BQ_SDI: IC7.80(GPIO24/ECAP1/SPISIMOB) ; also sheet 11,15
BQ_SDO: IC7.76(GPIO13/!TZ2!/SPISOMIB) ; also sheet 11,15
CAN-RX: IC7.33(GPIO30/CANRXA) ; also sheet 13
CAN-TX: IC7.32(GPIO31/CANTXA) ; also sheet 13,14
GND [LV]: C149.2 C150.2 C151.2 C152.2 C153.2 C154.2 IC7.8(VSS) IC7.35(VSS) IC7.53(VSS) IC7.71(VSS) IC7.73(!VREGENZ) L3.A R154.2 ; also sheet 10,11,13,14,15
LED: IC7.34(GPIO29/SCITXDA/SCLA/!TZ3) ; also sheet 14
N$42: C153.1 IC7.36(VDDIO) L2.B
N$50: C154.1 IC7.70(VDDIO) L1.B
N$51: C149.1 IC7.72(VDD)
N$52: C150.1 IC7.54(VDD)
N$91: C151.1 IC7.7(VDD)
N$92: C152.1 IC7.20(VDDA) L4.B
N$93: IC7.21(VSSA) L3.B
PWROUT_INT: IC7.12(ADCINA6/COMP3A/AIO6) ; also sheet 10
TCK: IC7.57(GPIO38/TCK/XCLKIN) ; also sheet 14
TDI: IC7.59(GPIO35/TDI) ; also sheet 14
TDO: IC7.58(GPIO37/TDO) ; also sheet 14
TMS: IC7.60(GPIO36/TMS) ; also sheet 14
Unconnected: IC7.2(GPIO32/SDAA/EPWMSYNCI/!ADCSOCAO) IC7.3(GPIO33/SCLA/EPWMSYNCO/!ADCSOCBO) IC7.4(GPIO23/EQEP1I/LINRXA) IC7.5(GPIO42/COMP1OUT) IC7.6(GPIO43/COMP42OUT) IC7.11(ADCINA7) IC7.13(ADCINA5) IC7.14(ADCINA4/COMP2A/AIO4) IC7.15(ADCINA3) IC7.16(ADCINA2/COMP1A/AIO2) IC7.17(ADCINA1) IC7.18(ADCINA0) IC7.19(VREFHI) IC7.22(VREFLO) IC7.23(ADCINB0) IC7.24(ADCINB1) IC7.25(ADCINB2/COMP1B/AIO10) IC7.26(ADCINB3) IC7.27(ADCINB4/COMP2B/AIO12) IC7.28(ADCINB5) IC7.29(ADCINB6/COMP3B/AIO14) IC7.30(ADCINB7) IC7.31(GPIO27/HRCAP2/!SPISTEB) IC7.37(GPIO26/HRCAP1/SPICLKB) IC7.38(TEST2) IC7.39(GPIO9/EPWM5B/LINTXA/HRCAP1) IC7.40(GPIO28/SCIRXDA/SDAA/!TZ2) IC7.41(GPIO18/SPICLKA/LINTXA/XCLKOUT) IC7.42(GPIO17/SPISOMIA/!TZ3) IC7.43(GPIO8/EPWM5A/!ADCSOCAO) IC7.44(GPIO25/SPISOMIB) IC7.45(GPIO44) IC7.46(GPIO16/SPISOMIA/!TZ2) IC7.47(GPIO12/!TZ1!/SCITXDA/SPISOMIB) IC7.48(GPIO41/EPWM7B) IC7.49(GPIO7/EPWM4B/SCIRXDA) IC7.50(GPIO6/EPWM4A/EPWMSYNCI/EPWMSYNCO) IC7.51(X2) IC7.52(X1) IC7.55(GPIO19/XCLKIN/!SPISTEA!/LINRXA/ECAP1) IC7.56(GPIO39) IC7.61(GPIO11/EPWM6B/LINRXA/HRCAP2) IC7.62(GPIO5/EPWM6B/LINRXA/HRCAP2) IC7.63(GPIO4/EPWM3A) IC7.64(GPIO40/EPWM7A) IC7.65(GPIO10/EPWM6A/!ADCSOCBO) IC7.66(GPIO3/EPWM2B/SPISOMIA/COMP2OUT) IC7.67(GPIO2/EPWM2A) IC7.68(GPIO1/EPWM1B/COMP1OUT) IC7.69(GPIO0/EPWM1A) IC7.74(GPIO34/COMP2OUT/COMP3OUT) IC7.75(GPIO15/!TZ1!/LINRXA/!SPISTEB) IC7.79(GPIO21/EQEP1B/COMP2OUT)

### Notes on the sheet
- F28035 connections

## Sheet 13 of 15
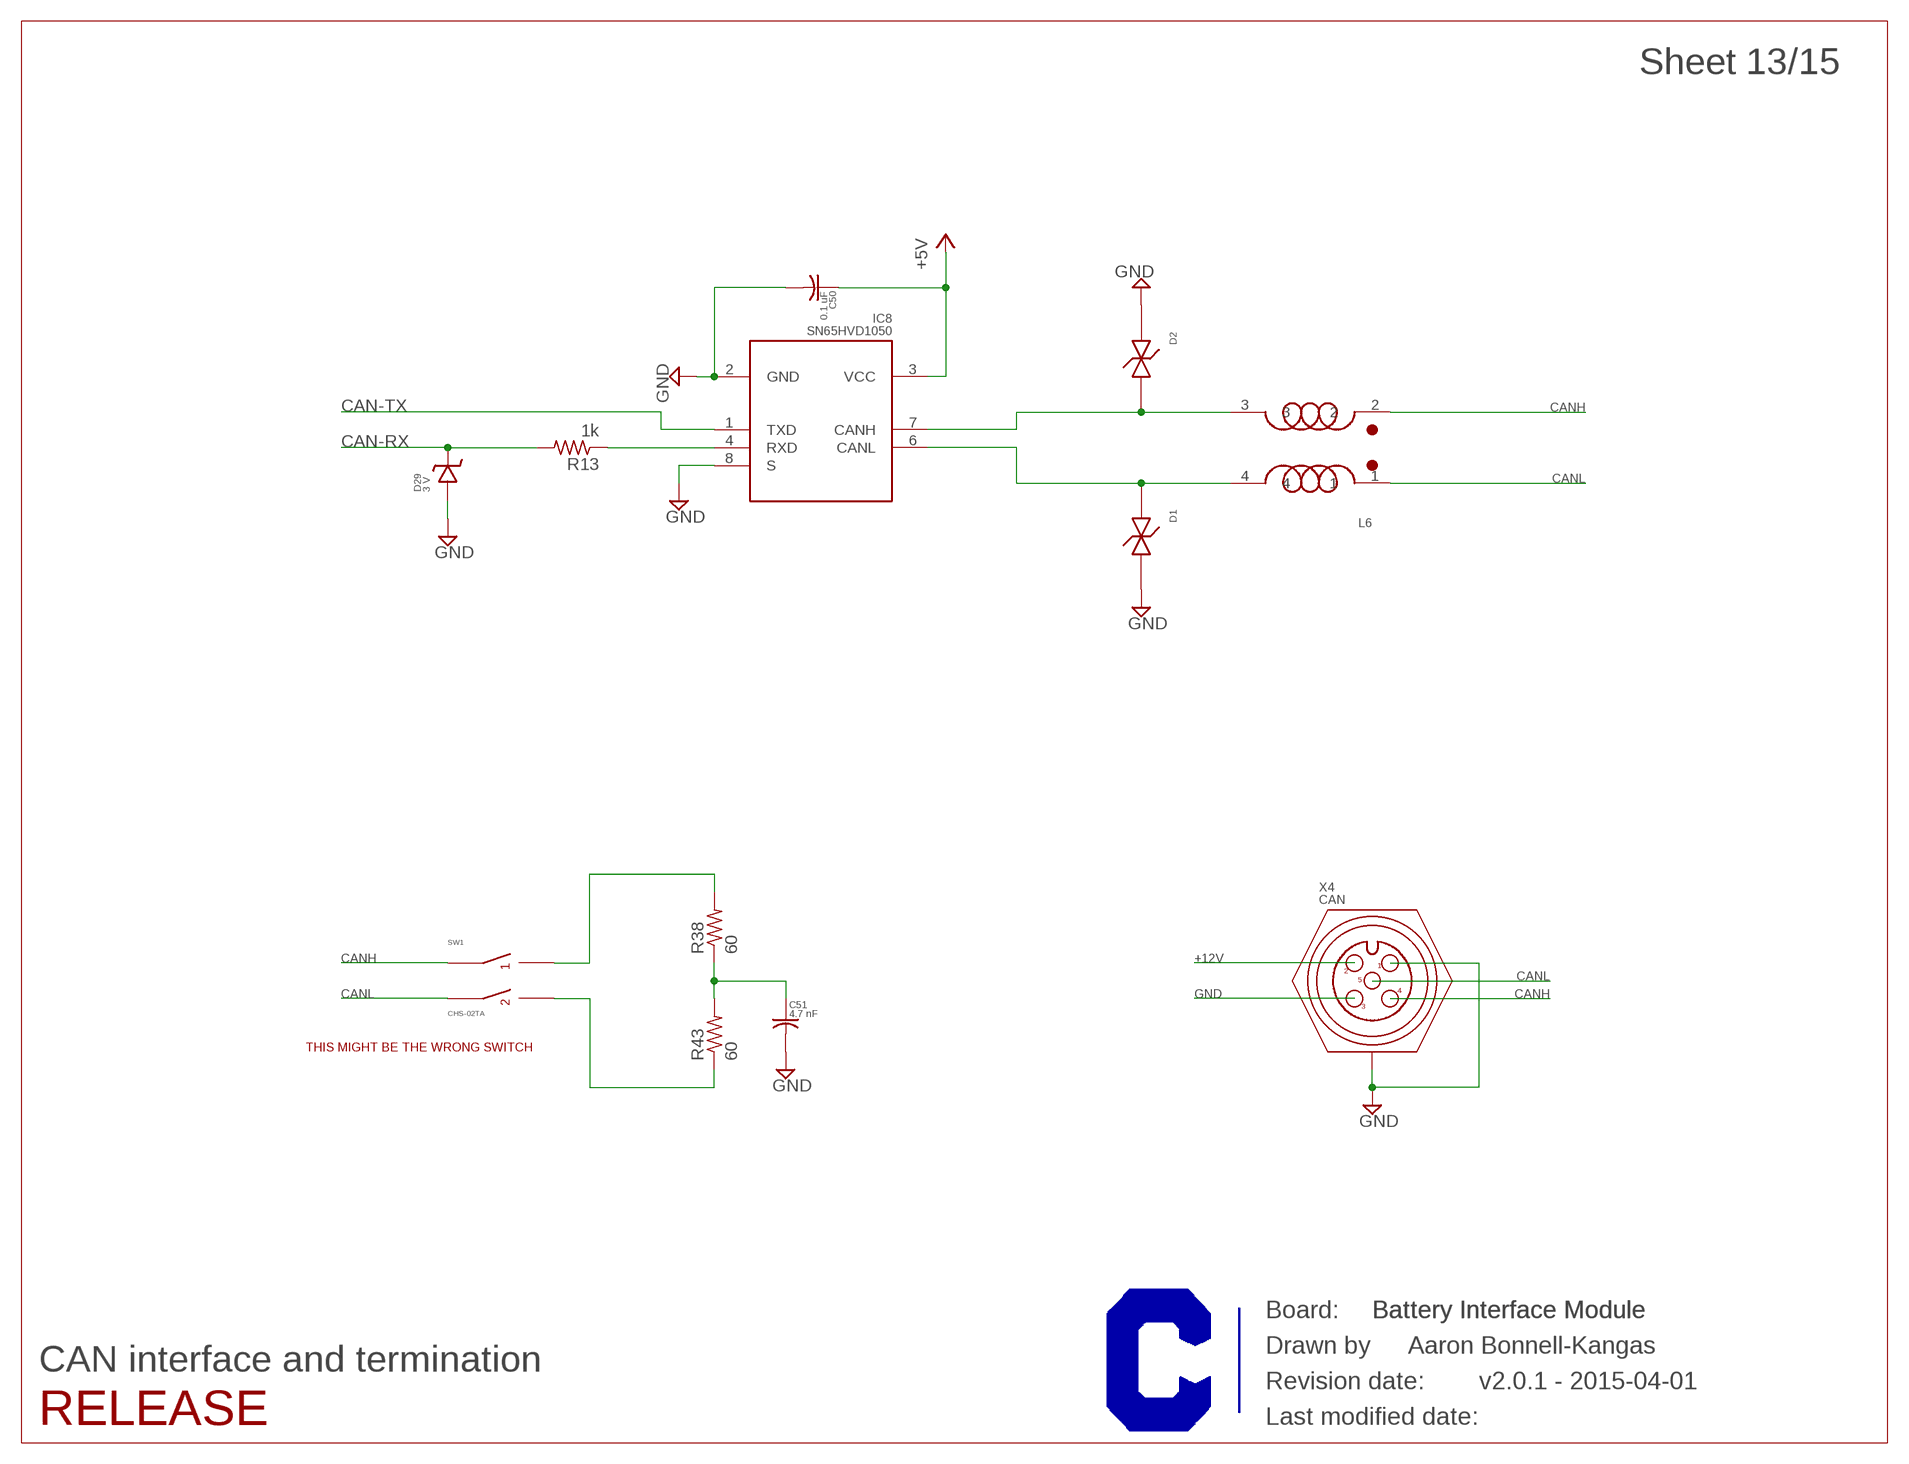
[diagram p12: schematic, sheet 13]

### Parts
C50  0.1 uF  C-USC0603  [C0603]
C51  4.7 nF  C-USC0603  [C0603]
D1  SMBJ30CA  [DO-214AA]
D2  SMBJ30CA  [DO-214AA]
D29  3 V  ZENER_DIODE-SOD-323  [SOD-323]
IC8  SN65HVD1050  [D_(R-PDSO-G8)]
L6  DR331-513AE  [SMD]
R13  1k  R-US_R0603  [R0603]
R38  60  R-US_R0603  [R0603]
R43  60  R-US_R0603  [R0603]
SW1  CHS-02TA  [CHS-02TA]
X4  CAN  M12-5-RA-PCB-MALE  [M12-RA-PCB]

### Nets
+5V: C50.1 IC8.3(VCC) ; also sheet 10,15
+12V: X4.2 ; also sheet 10,15
CAN-RX: D29.CATHODE R13.2 ; also sheet 12
CAN-TX: IC8.1(TXD) ; also sheet 12,14
CANH: L6.2 SW1.1A X4.4
CANL: L6.1 SW1.2A X4.5
GND [LV]: C50.2 C51.2 D1.2 D2.1 D29.ANODE IC8.2(GND) IC8.8(S) X4.1 X4.3 X4.SHIELD ; also sheet 10,11,12,14,15
N$14: D2.2 IC8.7(CANH) L6.3
N$22: D1.1 IC8.6(CANL) L6.4
N$39: R38.2 SW1.1B
N$40: R43.1 SW1.2B
N$41: C51.1 R38.1 R43.2
N$56: IC8.4(RXD) R13.1

### Notes on the sheet
- THIS MIGHT BE THE WRONG SWITCH
- CAN interface and termination

## Sheet 14 of 15
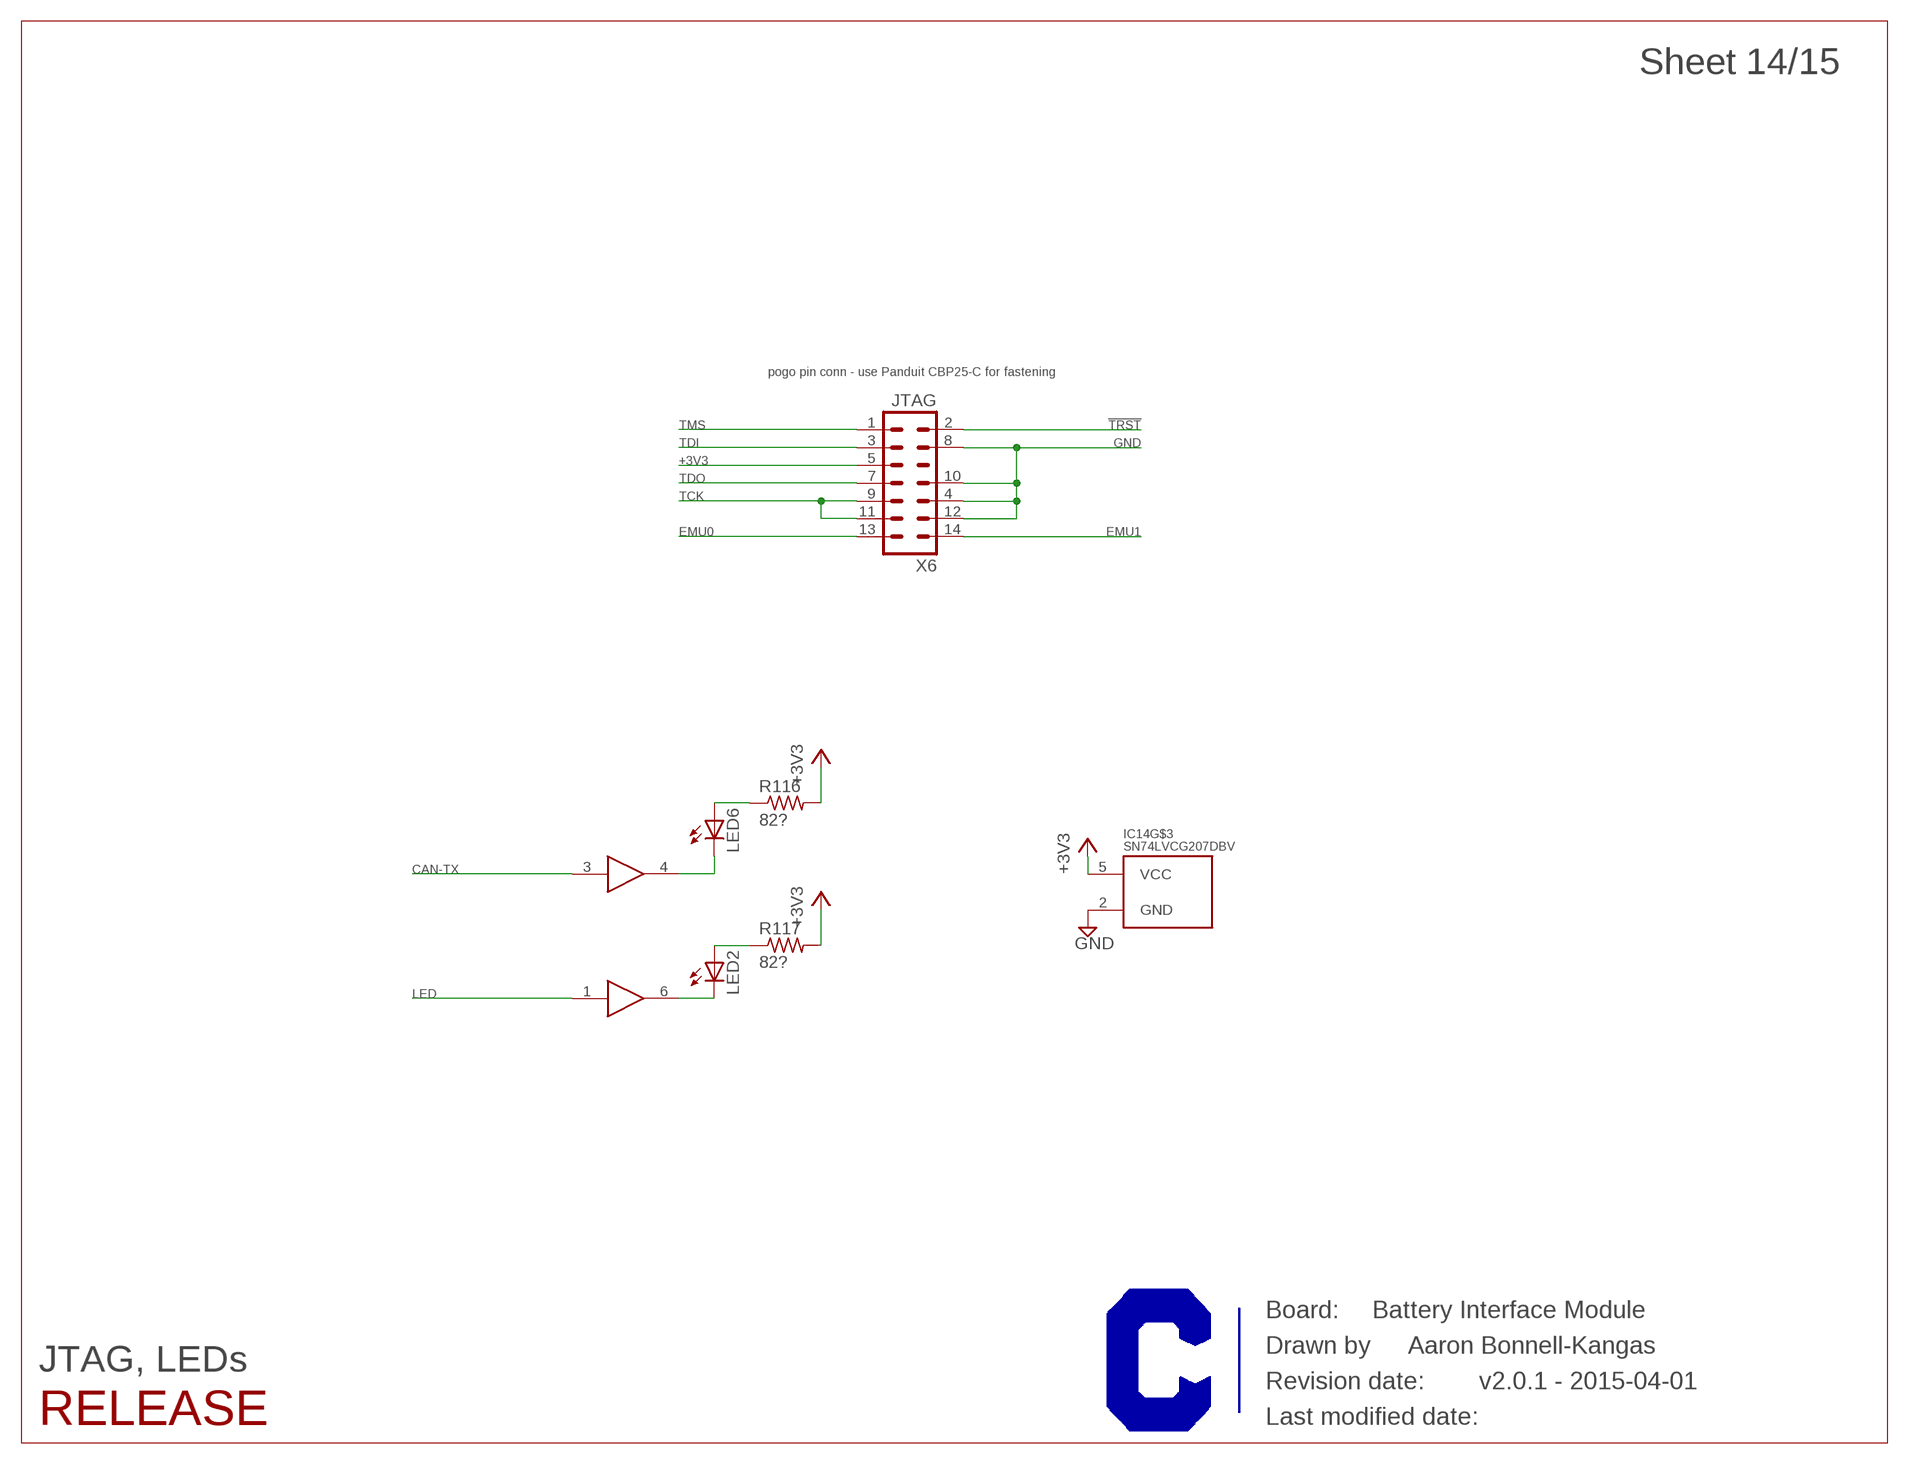
[diagram p13: schematic, sheet 14]

### Parts
IC14  SN74LVCG207DBV  [DBV_(R-PDSO-G6)]
LED2  LEDCHIP-LED0603  [CHIP-LED0603]
LED6  LEDCHIP-LED0603  [CHIP-LED0603]
R116  82?  R-US_R0805  [R0805]
R117  82?  R-US_R0805  [R0805]
X6  JTAG  JTAG_HEADER-0.05"-SMT-VERT  [TI_JTAG_HEADER_0.05"_SMT]

### Nets
!TRST: X6.2(!TRST) ; also sheet 12
+3V3 [LV]: IC14.5(VCC) R116.2 R117.2 X6.5(VTREF) ; also sheet 10,11,12,15
CAN-TX: IC14.3(A) ; also sheet 12,13
EMU0: X6.13(EMU0)
EMU1: X6.14(EMU1)
GND [LV]: IC14.2(GND) X6.4(GND) X6.8(GND) X6.10(GND) X6.12(GND) ; also sheet 10,11,12,13,15
LED: IC14.1(A) ; also sheet 12
N$131: IC14.6(Y) LED2.C
N$132: LED2.A R117.1
N$133: IC14.4(Y) LED6.C
N$134: LED6.A R116.1
TCK: X6.9(TCK) X6.11 ; also sheet 12
TDI: X6.3(TDI) ; also sheet 12
TDO: X6.7(TDO) ; also sheet 12
TMS: X6.1(TMS) ; also sheet 12

### Notes on the sheet
- pogo pin conn - use Panduit CBP25-C for fastening
- JTAG, LEDs

## Sheet 15 of 15
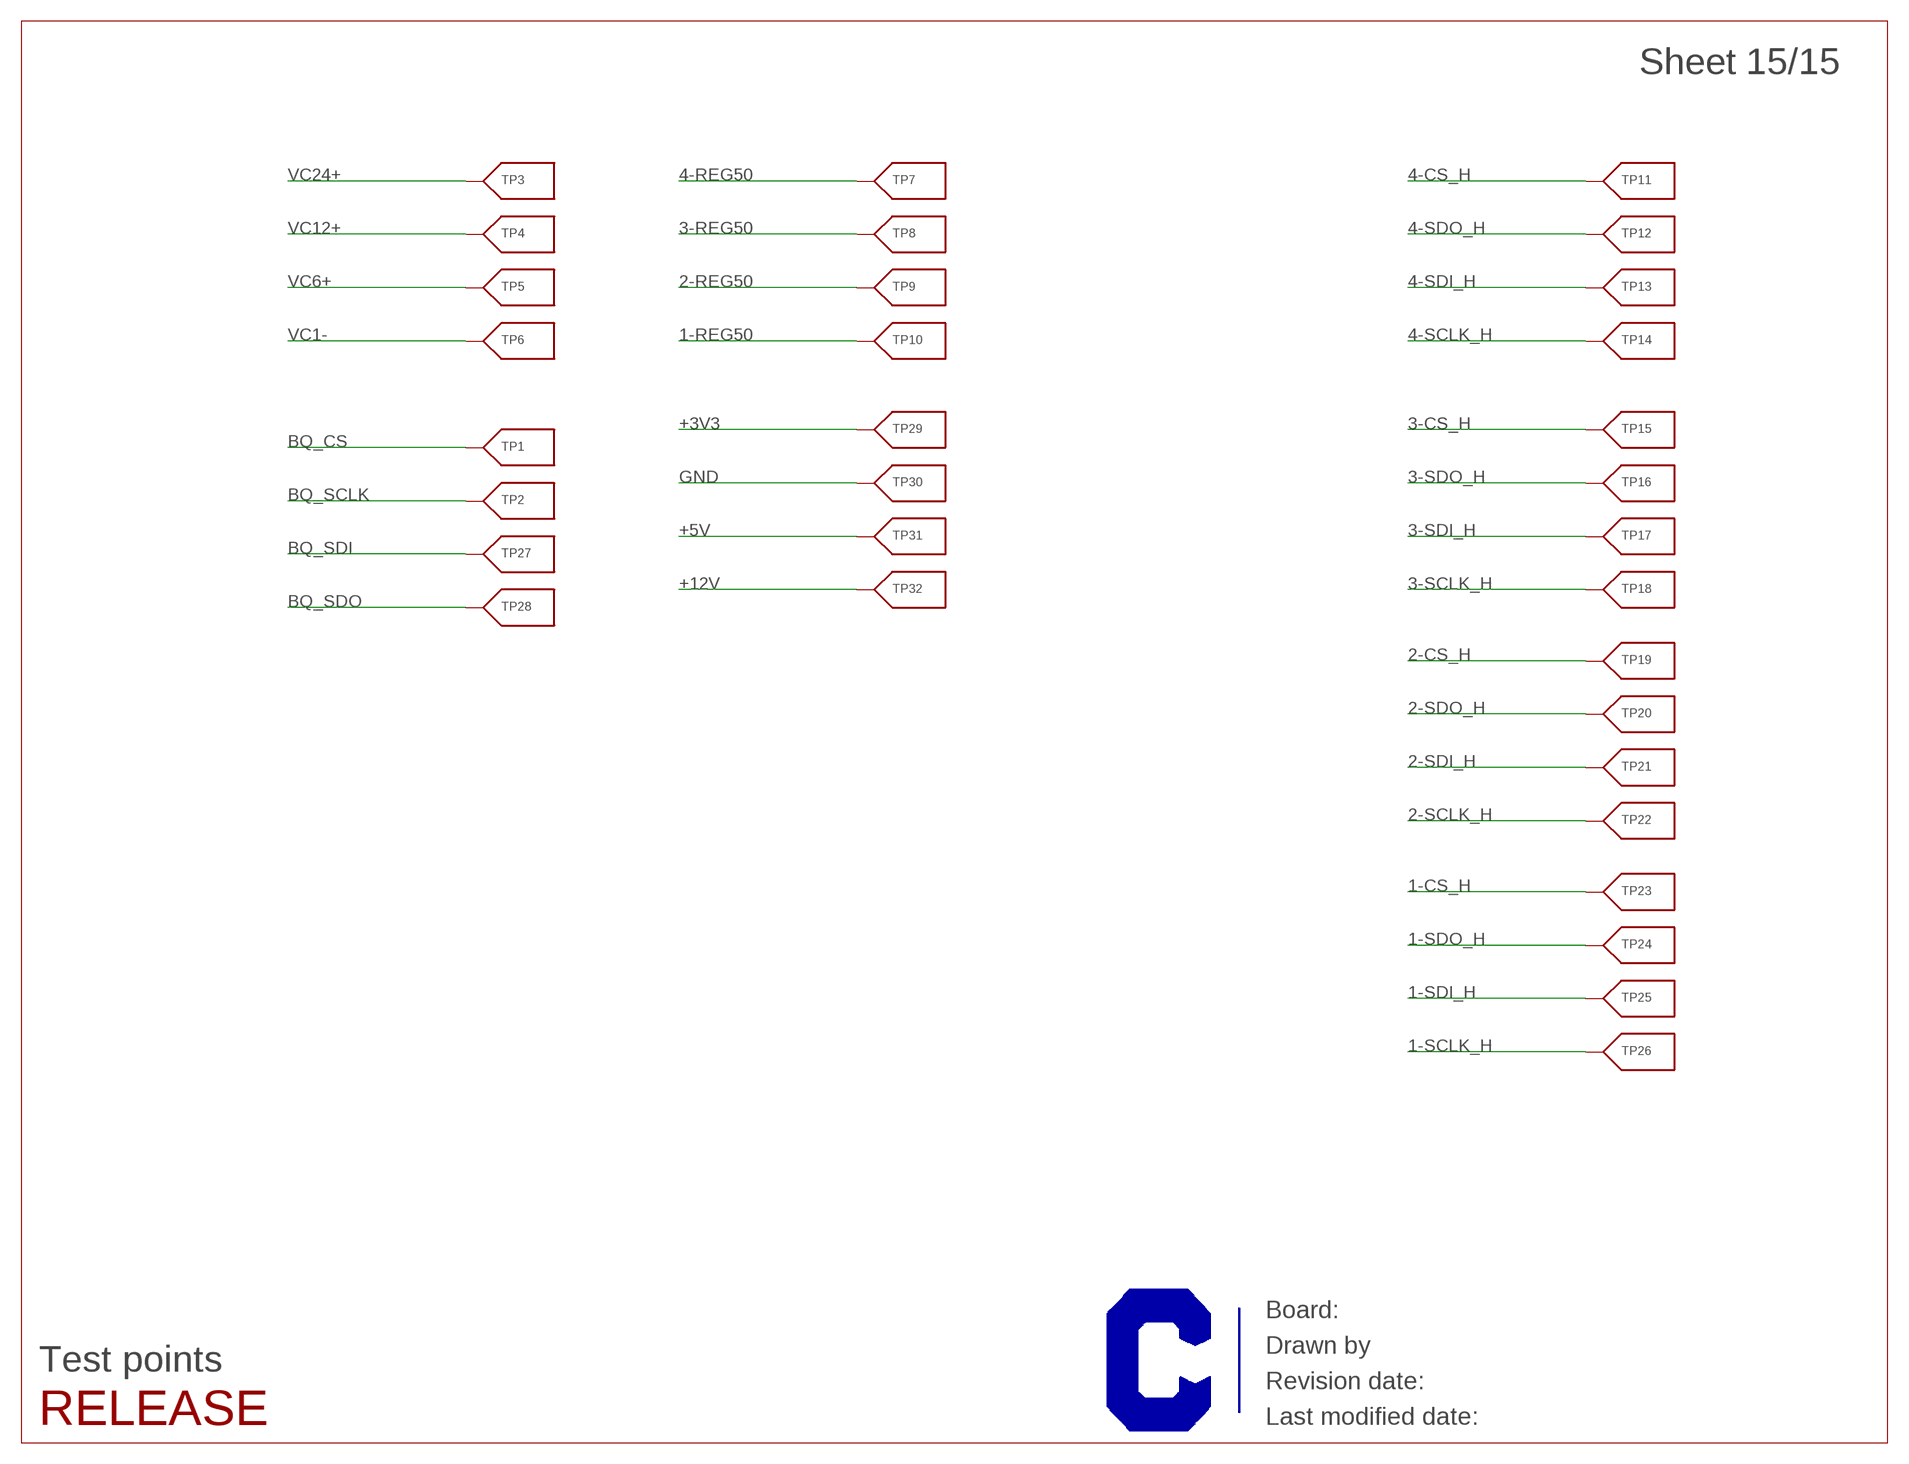
[diagram p14: schematic, sheet 15]

### Parts
TP1  SMD_TEST_POINT-TARGET  [TEST_POINT_TARGET]
TP2  SMD_TEST_POINT-TARGET  [TEST_POINT_TARGET]
TP3  SMD_TEST_POINT-TARGET  [TEST_POINT_TARGET]
TP4  SMD_TEST_POINT-TARGET  [TEST_POINT_TARGET]
TP5  SMD_TEST_POINT-TARGET  [TEST_POINT_TARGET]
TP6  SMD_TEST_POINT-TARGET  [TEST_POINT_TARGET]
TP7  SMD_TEST_POINT-TARGET  [TEST_POINT_TARGET]
TP8  SMD_TEST_POINT-TARGET  [TEST_POINT_TARGET]
TP9  SMD_TEST_POINT-TARGET  [TEST_POINT_TARGET]
TP10  SMD_TEST_POINT-TARGET  [TEST_POINT_TARGET]
TP11  SMD_TEST_POINT-TARGET  [TEST_POINT_TARGET]
TP12  SMD_TEST_POINT-TARGET  [TEST_POINT_TARGET]
TP13  SMD_TEST_POINT-TARGET  [TEST_POINT_TARGET]
TP14  SMD_TEST_POINT-TARGET  [TEST_POINT_TARGET]
TP15  SMD_TEST_POINT-TARGET  [TEST_POINT_TARGET]
TP16  SMD_TEST_POINT-TARGET  [TEST_POINT_TARGET]
TP17  SMD_TEST_POINT-TARGET  [TEST_POINT_TARGET]
TP18  SMD_TEST_POINT-TARGET  [TEST_POINT_TARGET]
TP19  SMD_TEST_POINT-TARGET  [TEST_POINT_TARGET]
TP20  SMD_TEST_POINT-TARGET  [TEST_POINT_TARGET]
TP21  SMD_TEST_POINT-TARGET  [TEST_POINT_TARGET]
TP22  SMD_TEST_POINT-TARGET  [TEST_POINT_TARGET]
TP23  SMD_TEST_POINT-TARGET  [TEST_POINT_TARGET]
TP24  SMD_TEST_POINT-TARGET  [TEST_POINT_TARGET]
TP25  SMD_TEST_POINT-TARGET  [TEST_POINT_TARGET]
TP26  SMD_TEST_POINT-TARGET  [TEST_POINT_TARGET]
TP27  SMD_TEST_POINT-TARGET  [TEST_POINT_TARGET]
TP28  SMD_TEST_POINT-TARGET  [TEST_POINT_TARGET]
TP29  SMD_TEST_POINT-TARGET  [TEST_POINT_TARGET]
TP30  SMD_TEST_POINT-TARGET  [TEST_POINT_TARGET]
TP31  SMD_TEST_POINT-TARGET  [TEST_POINT_TARGET]
TP32  SMD_TEST_POINT-TARGET  [TEST_POINT_TARGET]

### Nets
1-CS_H: TP23.P$1 ; also sheet 8,11
1-REG50: TP10.P$1 ; also sheet 7,8,9
1-SCLK_H: TP26.P$1 ; also sheet 8,11
1-SDI_H: TP25.P$1 ; also sheet 8,11
1-SDO_H: TP24.P$1 ; also sheet 8,11
2-CS_H: TP19.P$1 ; also sheet 6
2-REG50: TP9.P$1 ; also sheet 5,6,9
2-SCLK_H: TP22.P$1 ; also sheet 6
2-SDI_H: TP21.P$1 ; also sheet 6
2-SDO_H: TP20.P$1 ; also sheet 6
3-CS_H: TP15.P$1 ; also sheet 4
3-REG50: TP8.P$1 ; also sheet 3,4,9
3-SCLK_H: TP18.P$1 ; also sheet 4
3-SDI_H: TP17.P$1 ; also sheet 4
3-SDO_H: TP16.P$1 ; also sheet 4
4-CS_H: TP11.P$1 ; also sheet 2
4-REG50: TP7.P$1 ; also sheet 1,2,9
4-SCLK_H: TP14.P$1 ; also sheet 2
4-SDI_H: TP13.P$1 ; also sheet 2
4-SDO_H: TP12.P$1 ; also sheet 2
+3V3 [LV]: TP29.P$1 ; also sheet 10,11,12,14
+5V: TP31.P$1 ; also sheet 10,13
+12V: TP32.P$1 ; also sheet 10,13
BQ_CS: TP1.P$1 ; also sheet 11,12
BQ_SCLK: TP2.P$1 ; also sheet 11,12
BQ_SDI: TP27.P$1 ; also sheet 11,12
BQ_SDO: TP28.P$1 ; also sheet 11,12
GND [LV]: TP30.P$1 ; also sheet 10,11,12,13,14
VC1- [HV]: TP6.P$1 ; also sheet 6,7,8,9,11
VC6+ [HV]: TP5.P$1 ; also sheet 4,5,6,7,8,9
VC12+ [HV]: TP4.P$1 ; also sheet 2,3,4,5,6,9
VC24+ [HV]: TP3.P$1 ; also sheet 1,2,9

### Notes on the sheet
- Test points

## Library data of the parts
C1-C54 C73-C92 C101-C108 C117-C136 C149-C154 C157-C160 C165-C168 C171-C175 C181-C184 C189-C191 = rcl:C-US: CAPACITOR, American symbol
C192 = rcl:C-EU: CAPACITOR, European symbol
D1 D2 = Littelfuse:SMBJ30CA: Bidirectional TVS Zener Diode 30V Breakdown http://www.digikey.com/product-detail/en/SMBJ30CA/SMBJ30CALFCT-ND/286112; PARTNO: SMBJ30CALFCT-ND
D3-D16 D19-D29 = Diodes:ZENER_DIODE
D17 = Diodes:SCHOTTKY_DIODE
D18 = diode:DIODE-: DIODE
IC1-IC4 = TI:BQ76PL536: bq76pl536a - 3 to 6 Series Cell Lithium-Ion Battery Monitor and Secondary Protection IC for EV and HEV Applications Datasheet: http://www.ti.com/lit/ds/symlink/bq76pl536a.pdf Product page: http://www.ti.com/product/bq76pl536a
IC6 = TI:LP38693: TI LP38693-3.3 LDO 500mA Very Low Vdo. http://www.ti.com/lit/ds/symlink/lp38693.pdf
IC7 = TI:TMS320F28034: TMS320F2803x (Piccolo) 32-Bit High-Efficiency MCU Datasheet: http://www.ti.com/lit/ds/sprs584j/sprs584j.pdf Product page: http://www.ti.com/product/tms320f28034; PARTNO: TMS320F28035PNT
IC8 = TI:SN65HVD1050: SN65HVD1050 - EMC Optimized CAN Transceiever Datasheet: http://www.ti.com/lit/ds/symlink/sn65hvd1050.pdf; PARTNO: SN65HVD1050D
IC9 = TI:ISO7241: ISO7241: HIGH SPEED QUAD DIGITAL ISOLATORS Website: http://www.ti.com/product/iso7241c Datasheet: http://www.ti.com/lit/ds/symlink/iso7241c.pdf The ISO7241 has three channels one way, one channel the other way.
IC11 = BMC components:ADUM5000: ADuM5000 2.5 kV, Isolated DC-to-DC Converter Provides regulated, isolated 3.3V or 5V output at 3.3V or 5V in, at up to 500 mW output power. Datasheet: http://www.analog.com/static/imported-files/data_sheets/ADuM5000.pdf Product page: http://www.analog.com/en/interface/digital-isolators/adum5000/products/product.html
IC14 = TI:SN74LVCG207: SN74LVC2G07: Dual Buffer/Driver with Open Drain Outputs no datasheet 4 u!!
IC15 = TI:LMR14206: LMR14206 SIMPLE SWITCHER® 42Vin, 0.6A Step-Down Voltage Regulator in SOT-23 Datasheet: http://www.ti.com/lit/ds/symlink/lmr14206.pdf
L1-L4 = Passives:INDUCTOR
L5 = Bourns:SDR0604: SDR0604 Series - SMD Power Inductors From http://www.bourns.com/data/global/pdfs/SDR0604.pdf
L6 = Bourns:DR331-513AE: Bourns Common Mode Choke; PARTNO: DR331-513AECT-ND
LED1-LED6 = led:LED: LED OSRAM: - CHIPLED LG R971, LG N971, LY N971, LG Q971, LY Q971, LO R971, LY R971 LH N974, LH R974 LS Q976, LO Q976, LY Q976 LO Q996 - Hyper CHIPLED LW Q18S LB Q993, LB Q99A, LB R99A - SideLED LS A670, LO A670, LY A670, LG A670, LP A670 LB A673, LV A673, LT A673, LW A673 LH A674 LY A675 LS A676, LA A676, LO A676, LY A676, LW A676 LS A679, LY A679, LG A679 - Hyper Micro SIDELED® LS Y876, LA Y876, LO Y876, LY Y876 LT Y87S - SmartLED LW L88C, LW L88S LB L89C, LB L89S, LG L890 LS L89K, LO L89K, LY L89K LS L896, LA L896, LO L896, LY L896 - TOPLED LS T670, LO T670, LY T670, LG T670, LP T670 LSG T670, LSP T670, LSY T670, LOP T670, LYG T670 LG T671, LOG T671, LSG T671 LB T673, LV T673, LT T673, LW T673 LH T674 LS T676, LA T676, LO T676, LY T676, LB T676, LH T676, LSB T676, LW T676 LB T67C, LV T67C, LT T67C, LS T67K, LO T67K, LY T67K, LW E67C LS E67B, LA E67B, LO E67B, LY E67B, LB E67C, LV E67C, LT E67C LW T67C LS T679, LY T679, LG T679 LS T770, LO T770, LY T770, LG T770, LP T770 LB T773, LV T773, LT T773, LW T773 LH T774 LS E675, LA E675, LY E675, LS T675 LS T776, LA T776, LO T776, LY T776, LB T776 LHGB T686 LT T68C, LB T68C - Hyper Mini TOPLED® LB M676 - Mini TOPLED Santana® LG M470 LS M47K, LO M47K, LY M47K Source: http://www.osram.convergy.de LUXEON: - LUMILED® LXK2-PW12-R00, LXK2-PW12-S00, LXK2-PW14-U00, LXK2-PW14-V00 LXK2-PM12-R00, LXK2-PM12-S00, LXK2-PM14-U00 LXK2-PE12-Q00, LXK2-PE12-R00, LXK2-PE12-S00, LXK2-PE14-T00, LXK2-PE14-U00 LXK2-PB12-K00, LXK2-PB12-L00, LXK2-PB12-M00, LXK2-PB14-N00, LXK2-PB14-P00, LXK2-PB14-Q00 LXK2-PR12-L00, LXK2-PR12-M00, LXK2-PR14-Q00, LXK2-PR14-R00 LXK2-PD12-Q00, LXK2-PD12-R00, LXK2-PD12-S00 LXK2-PH12-R00, LXK2-PH12-S00 LXK2-PL12-P00, LXK2-PL12-Q00, LXK2-PL12-R00 Source: www.luxeon.com KINGBRIGHT: KA-3528ASYC Source: www.kingbright.com
Q37 Q39-Q41 = Fairchild Semiconductor:FDN359AN: FDN359AN - N-Channel Logic Level PowerTrench MOSFET Datasheet: http://datasheet.octopart.com/FDN359AN-Fairchild-datasheet-83786.pdf
R1-R18 R20-R24 R26-R30 R32-R36 R38-R68 R80-R90 R114 R126 R128 R130 R132 R134-R149 R154 R155 R157 R158 R161 = rcl:R-US_: RESISTOR, American symbol
R116 R117 = resistor:R-US_: RESISTOR, American symbol
SW1 = Copal Electronics:CHS-02T: SLIDE SWITCHES (HALF PITCH) CHS - NN X Y Z NN: number of bits, {01, 02, 04, 06, 08, 10} X: packaging, T: taping (reel); M: magazine; blank: bulk Y: shape of terminal, A: J-hook; B: gull-wing Z: structure, 1: non-washable, no seal tape; 2: non-washable, with seal tape; blank: washable with seal tape Datasheet: http://copal-electronics.info/en/0008e/0267f.pdf
TP1-TP32 = Test points:SMD_TEST_POINT; BOM: EXCLUDE
U$2 U$17 = Logos:HV_SYMBOL; BOM: EXCLUDE
X2 X3 = Molex:MICROCLASP-20-DUAL
X4 = Conec:M12-5: http://media.digikey.com/pdf/Data%20Sheets/Conec%20PDFs/43-01208-11_Dwg.pdf; PARTNO: 43-01211
X6 = TI:JTAG_HEADER: TI 14-pin JTAG header Reference: http://processors.wiki.ti.com/index.php/JTAG_Connectors; PARTNO: FTS-107-01-F-DV

## Net classes
1 HV: clearance 0.1 mm
2 LV: clearance 1 mm to class 1